# Altium project Ravage.PrjPcb (part 1 of 2)
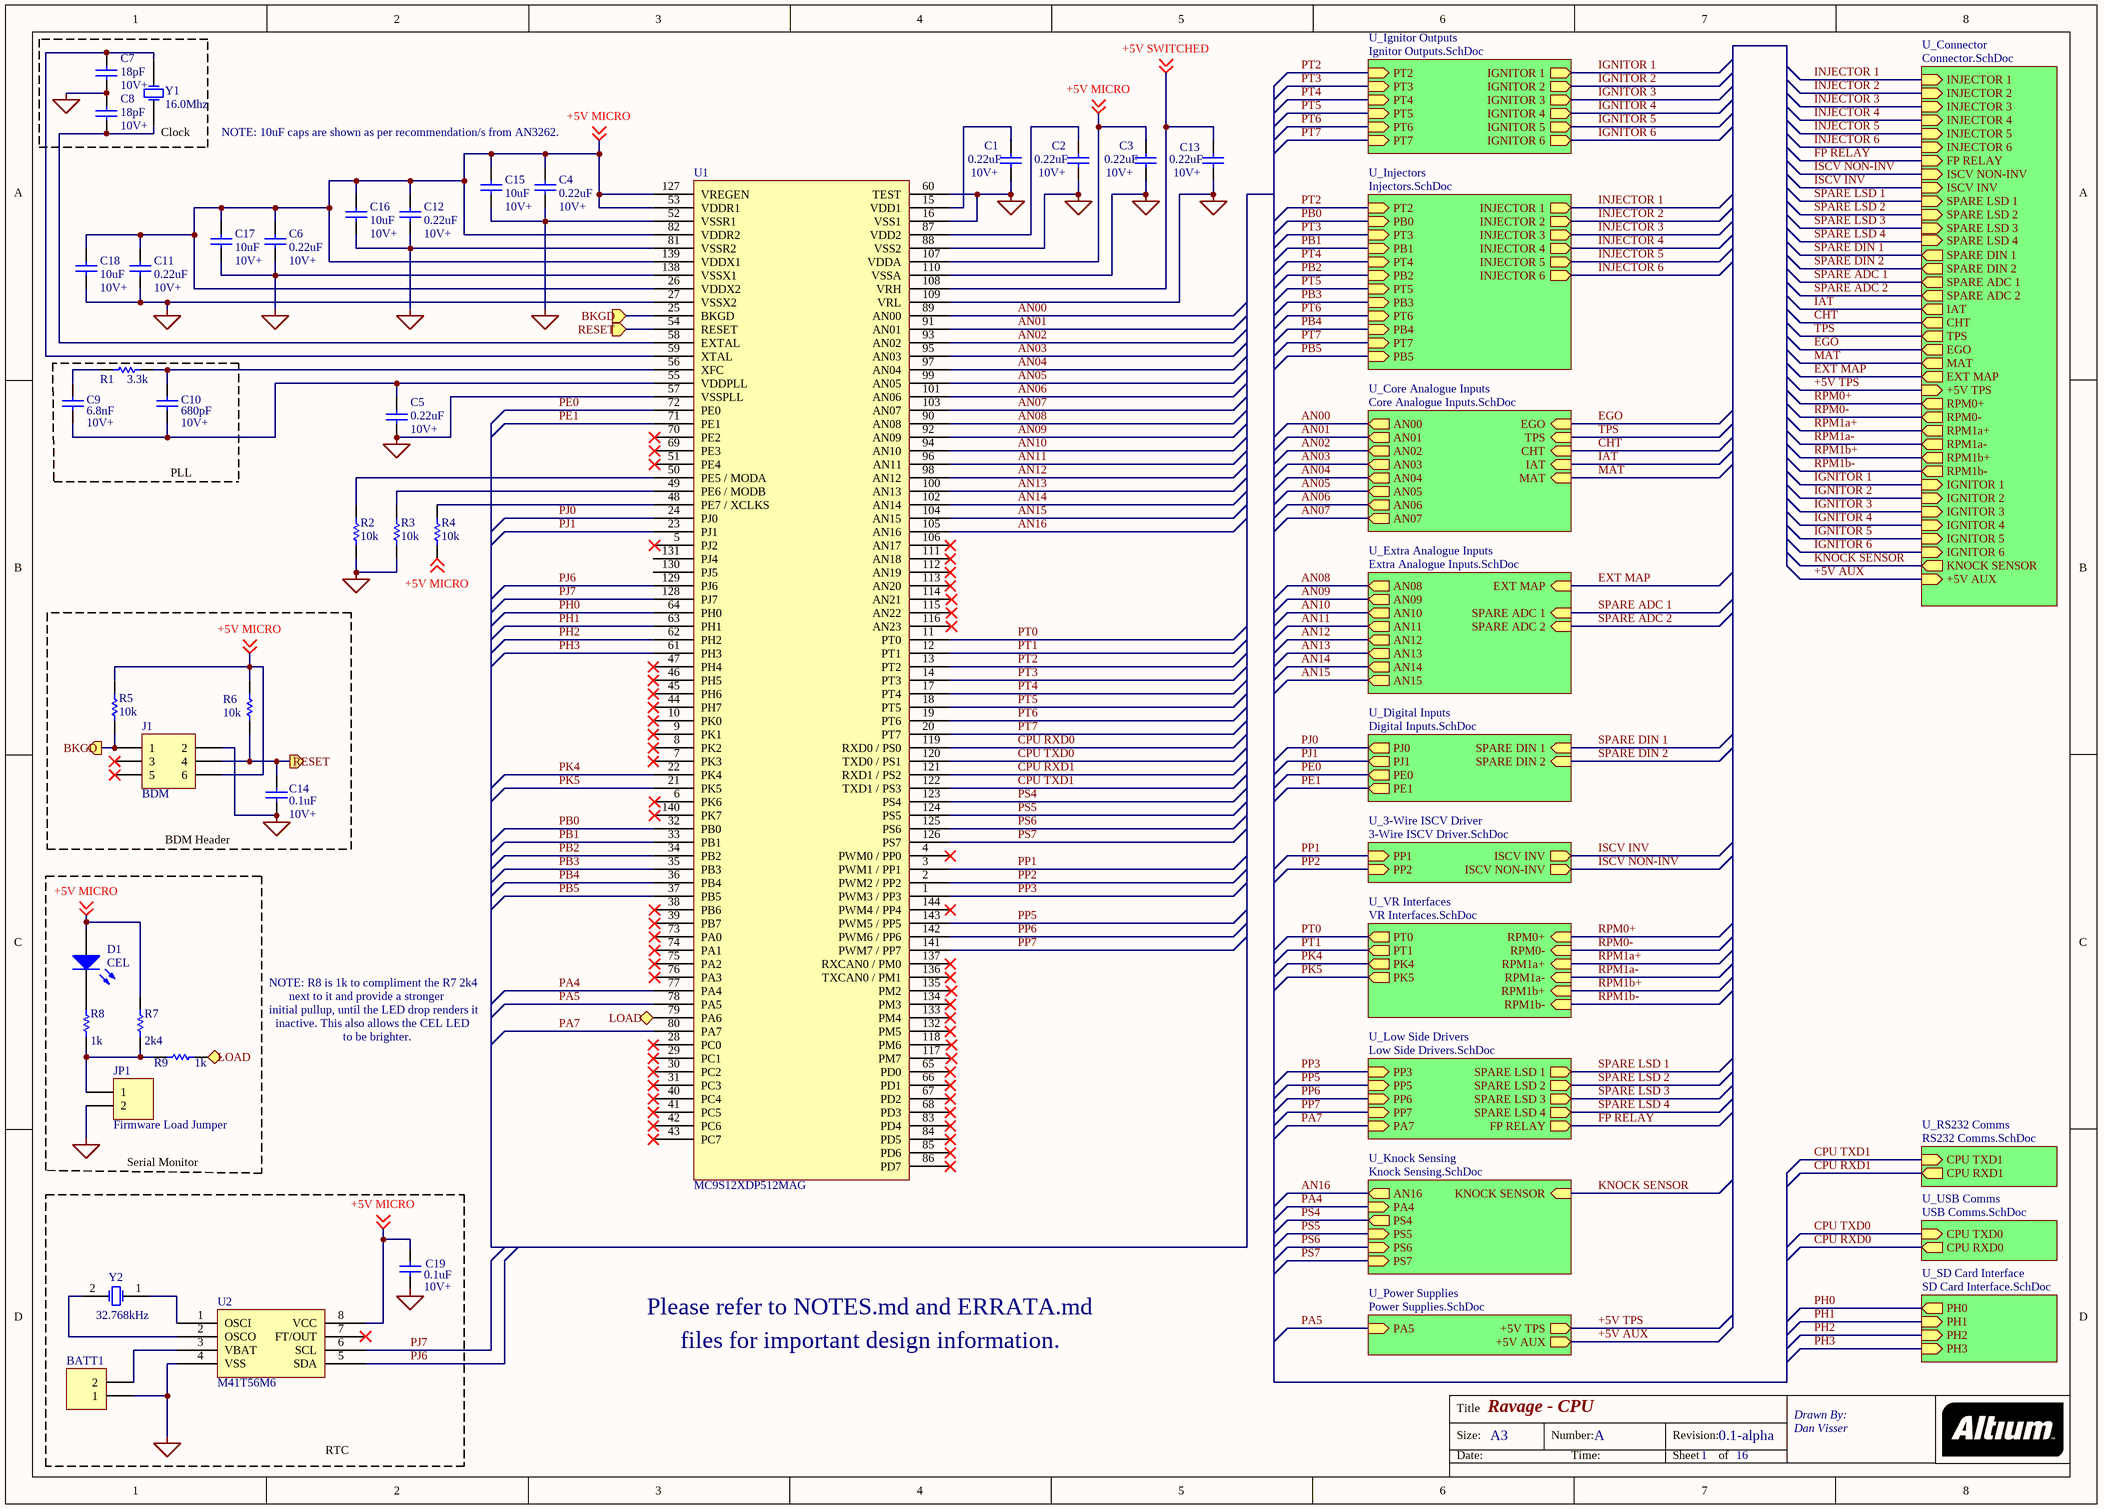
[diagram p0: CPU.SchDoc]
16 sheets, 377 parts. Net scope: hierarchical (ports join the sheet entries above them; power ports are global).
Board file: RavAGE-0.1-alpha.PcbDoc
Sheets:
  CPU.SchDoc
    U_Ignitor Outputs = Ignitor Outputs.SchDoc
    U_Injectors = Injectors.SchDoc
    U_Digital Inputs = Digital Inputs.SchDoc
    U_USB Comms = USB Comms.SchDoc
    U_3-Wire ISCV Driver = 3-Wire ISCV Driver.SchDoc
    U_Power Supplies = Power Supplies.SchDoc
    U_VR Interfaces = VR Interfaces.SchDoc
    U_Connector = Connector.SchDoc
    U_RS232 Comms = RS232 Comms.SchDoc
    U_Core Analogue Inputs = Core Analogue Inputs.SchDoc
    U_Extra Analogue Inputs = Extra Analogue Inputs.SchDoc
    U_Low Side Drivers = Low Side Drivers.SchDoc
    U_Knock Sensing = Knock Sensing.SchDoc
    U_SD Card Interface = SD Card Interface.SchDoc
  IO Expansion Header.SchDoc

## Sheet CPU.SchDoc: Ravage - CPU
size A3; Author: Dan Visser; CompanyName: DIYEFI; DrawnBy: Dan Visser; Engineer: Dan Visser; Address1: Drawn By:; Address2: Dan Visser; DocumentNumber: A; Revision: 0.1-alpha; SheetNumber: 1; SheetTotal: 16

### Parts
BATT1  (no value)  [HDR1X2]
C1  value 0.22uF  [RAD-0.3]
C2  value 0.22uF  [RAD-0.3]
C3  value 0.22uF  [RAD-0.3]
C4  value 0.22uF  [RAD-0.3]
C5  value 0.22uF  [RAD-0.3]
C6  value 0.22uF  [RAD-0.3]
C7  value 18pF  [RAD-0.3]
C8  value 18pF  [RAD-0.3]
C9  value 6.8nF  [RAD-0.3]
C10  value 680pF  [RAD-0.3]
C11  value 0.22uF  [RAD-0.3]
C12  value 0.22uF  [RAD-0.3]
C13  value 0.22uF  [RAD-0.3]
C14  value 0.1uF  [RAD-0.3]
C15  value 10uF  [RAD-0.3]
C16  value 10uF  [RAD-0.3]
C17  value 10uF  [RAD-0.3]
C18  value 10uF  [RAD-0.3]
C19  value 0.1uF  [RAD-0.3]
D1  CEL  [LED-0]
J1  BDM  [HDR2X3]
JP1  Firmware Load Jumper  [HDR1X2]
R1  value 3.3k  [AXIAL-0.3]
R2  value 10k  [AXIAL-0.3]
R3  value 10k  [AXIAL-0.3]
R4  value 10k  [AXIAL-0.3]
R5  value 10k  [AXIAL-0.3]
R6  value 10k  [AXIAL-0.3]
R7  value 2k4  [AXIAL-0.3]
R8  value 1k  [AXIAL-0.3]
R9  value 1k  [AXIAL-0.3]
U1  MC9S12XDP512MAG
U2  M41T56M6
Y1  16.0Mhz  [R38]
Y2  32.768kHz  [R38]

### Blocks framed on the sheet
Serial Monitor: D1 JP1 R7-R9

### Sub-sheets
U_3-Wire ISCV Driver = 3-Wire ISCV Driver.SchDoc: PP1 (in), ISCV INV (out), ISCV NON-INV (out), PP2 (in)
U_Connector = Connector.SchDoc: INJECTOR 1 (in), INJECTOR 2 (in), INJECTOR 3 (in), INJECTOR 4 (in), INJECTOR 5 (in), INJECTOR 6 (in), FP RELAY (in), ISCV NON-INV (in), ISCV INV (in), SPARE LSD 1 (in), SPARE LSD 2 (in), IGNITOR 1 (in), RPM0+ (out), RPM0- (out), RPM1a+ (out), RPM1a- (out), RPM1b+ (out), RPM1b- (out), IAT (out), CHT (out), TPS (out), EGO (out), MAT (out), EXT MAP (out), SPARE ADC 1 (out), SPARE ADC 2 (out), SPARE DIN 1 (out), SPARE DIN 2 (out), IGNITOR 2 (in), IGNITOR 3 (in), IGNITOR 4 (in), IGNITOR 5 (in), IGNITOR 6 (in), SPARE LSD 3 (in), +5V TPS (in), SPARE LSD 4 (in), KNOCK SENSOR (out), +5V AUX (in)
U_Core Analogue Inputs = Core Analogue Inputs.SchDoc: AN00 (out), AN01 (out), AN02 (out), AN03 (out), AN04 (out), EGO (in), TPS (in), CHT (in), IAT (in), AN05 (out), AN06 (out), AN07 (out), MAT (in)
U_Digital Inputs = Digital Inputs.SchDoc: PJ0 (out), PE0 (out), PE1 (out), SPARE DIN 1 (in), PJ1 (out), SPARE DIN 2 (in)
U_Extra Analogue Inputs = Extra Analogue Inputs.SchDoc: AN08 (out), AN09 (out), AN14 (out), AN13 (out), AN12 (out), AN11 (out), AN10 (out), SPARE ADC 1 (in), SPARE ADC 2 (in), AN15 (out), EXT MAP (in)
U_Ignitor Outputs = Ignitor Outputs.SchDoc: PT3 (in), PT2 (in), PT4 (in), PT5 (in), PT7 (in), PT6 (in), IGNITOR 1 (out), IGNITOR 2 (out), IGNITOR 3 (out), IGNITOR 4 (out), IGNITOR 5 (out), IGNITOR 6 (out)
U_Injectors = Injectors.SchDoc: PB0 (in), PB1 (in), PB2 (in), PB5 (in), PT7 (in), INJECTOR 3 (out), PB4 (in), PT6 (in), INJECTOR 5 (out), INJECTOR 2 (out), INJECTOR 1 (out), INJECTOR 4 (out), PT5 (in), PB3 (in), PT2 (in), PT3 (in), PT4 (in), INJECTOR 6 (out)
U_Knock Sensing = Knock Sensing.SchDoc: PA4 (in), PS6 (in), PS7 (in), PS5 (in), AN16 (out), PS4 (out), KNOCK SENSOR (in)
U_Low Side Drivers = Low Side Drivers.SchDoc: PP3 (in), PP5 (in), PA7 (in), PP7 (in), SPARE LSD 3 (out), FP RELAY (out), SPARE LSD 4 (out), SPARE LSD 2 (out), SPARE LSD 1 (out), PP6 (in)
U_Power Supplies = Power Supplies.SchDoc: PA5 (in), +5V TPS (out), +5V AUX (out)
U_RS232 Comms = RS232 Comms.SchDoc: CPU TXD1 (in), CPU RXD1 (out)
U_SD Card Interface = SD Card Interface.SchDoc: PH0 (out), PH1 (in), PH2 (in), PH3 (in)
U_USB Comms = USB Comms.SchDoc: CPU TXD0 (in), CPU RXD0 (out)
U_VR Interfaces = VR Interfaces.SchDoc: PT1 (out), PT0 (out), PK4 (out), RPM1b- (in), RPM1b+ (in), RPM1a+ (in), RPM1a- (in), RPM0- (in), RPM0+ (in), PK5 (out)

### Ports
BKGD (in), BKGD (out), LOAD (bidir), RESET (in), RESET (out)

### Nets
SENSOR GND: BATT1.1 C1.1 C2.1 C3.1 C4.1 C5.2 C6.1 C7.1 C8.2 C11.1 C12.1 C13.1 C14.2 C15.1 C16.1 C17.1 C18.1 C19.2 J1.2 JP1.2 R2.1 R3.1 U1.16(VSS1) U1.27(VSSX2) U1.52(VSSR1) U1.57(VSSPLL) U1.60(TEST) U1.81(VSSR2) U1.88(VSS2) U1.109(VRL) U1.110(VSSA) U1.138(VSSX1) U2.4(VSS)
+5V AUX: sheet U_Power Supplies/+5V AUX, sheet U_Connector/+5V AUX
+5V MICRO: C3.2 C4.2 C6.2 C11.2 C12.2 C15.2 C16.2 C17.2 C18.2 C19.1 D1.1(A) J1.6 R4.1 R5.2 R6.2 R7.2 U1.26(VDDX2) U1.53(VDDR1) U1.82(VDDR2) U1.107(VDDA) U1.127(VREGEN) U1.139(VDDX1) U2.8(VCC) ; off-sheet +5V MICRO
+5V SWITCHED: C13.2 U1.108(VRH) ; off-sheet +5V SWITCHED
+5V TPS: sheet U_Power Supplies/+5V TPS, sheet U_Connector/+5V TPS
AN00: U1.89(AN00) ; sheet U_Core Analogue Inputs/AN00
AN01: U1.91(AN01) ; sheet U_Core Analogue Inputs/AN01
AN02: U1.93(AN02) ; sheet U_Core Analogue Inputs/AN02
AN03: U1.95(AN03) ; sheet U_Core Analogue Inputs/AN03
AN04: U1.97(AN04) ; sheet U_Core Analogue Inputs/AN04
AN05: U1.99(AN05) ; sheet U_Core Analogue Inputs/AN05
AN06: U1.101(AN06) ; sheet U_Core Analogue Inputs/AN06
AN07: U1.103(AN07) ; sheet U_Core Analogue Inputs/AN07
AN08: U1.90(AN08) ; sheet U_Extra Analogue Inputs/AN08
AN09: U1.92(AN09) ; sheet U_Extra Analogue Inputs/AN09
AN10: U1.94(AN10) ; sheet U_Extra Analogue Inputs/AN10
AN11: U1.96(AN11) ; sheet U_Extra Analogue Inputs/AN11
AN12: U1.98(AN12) ; sheet U_Extra Analogue Inputs/AN12
AN13: U1.100(AN13) ; sheet U_Extra Analogue Inputs/AN13
AN14: U1.102(AN14) ; sheet U_Extra Analogue Inputs/AN14
AN15: U1.104(AN15) ; sheet U_Extra Analogue Inputs/AN15
AN16: U1.105(AN16) ; sheet U_Knock Sensing/AN16
CHT: sheet U_Connector/CHT, sheet U_Core Analogue Inputs/CHT
CPU RXD0: U1.119(RXD0_/_PS0) ; sheet U_USB Comms/CPU RXD0
CPU RXD1: U1.121(RXD1_/_PS2) ; sheet U_RS232 Comms/CPU RXD1
CPU TXD0: U1.120(TXD0_/_PS1) ; sheet U_USB Comms/CPU TXD0
CPU TXD1: U1.122(TXD1_/_PS3) ; sheet U_RS232 Comms/CPU TXD1
EGO: sheet U_Connector/EGO, sheet U_Core Analogue Inputs/EGO
EXT MAP: sheet U_Connector/EXT MAP, sheet U_Extra Analogue Inputs/EXT MAP
FP RELAY: sheet U_Connector/FP RELAY, sheet U_Low Side Drivers/FP RELAY
IAT: sheet U_Connector/IAT, sheet U_Core Analogue Inputs/IAT
IGNITOR 1: sheet U_Ignitor Outputs/IGNITOR 1, sheet U_Connector/IGNITOR 1
IGNITOR 2: sheet U_Ignitor Outputs/IGNITOR 2, sheet U_Connector/IGNITOR 2
IGNITOR 3: sheet U_Ignitor Outputs/IGNITOR 3, sheet U_Connector/IGNITOR 3
IGNITOR 4: sheet U_Ignitor Outputs/IGNITOR 4, sheet U_Connector/IGNITOR 4
IGNITOR 5: sheet U_Ignitor Outputs/IGNITOR 5, sheet U_Connector/IGNITOR 5
IGNITOR 6: sheet U_Ignitor Outputs/IGNITOR 6, sheet U_Connector/IGNITOR 6
INJECTOR 1: sheet U_Injectors/INJECTOR 1, sheet U_Connector/INJECTOR 1
INJECTOR 2: sheet U_Injectors/INJECTOR 2, sheet U_Connector/INJECTOR 2
INJECTOR 3: sheet U_Injectors/INJECTOR 3, sheet U_Connector/INJECTOR 3
INJECTOR 4: sheet U_Injectors/INJECTOR 4, sheet U_Connector/INJECTOR 4
INJECTOR 5: sheet U_Injectors/INJECTOR 5, sheet U_Connector/INJECTOR 5
INJECTOR 6: sheet U_Injectors/INJECTOR 6, sheet U_Connector/INJECTOR 6
ISCV INV: sheet U_3-Wire ISCV Driver/ISCV INV, sheet U_Connector/ISCV INV
ISCV NON-INV: sheet U_3-Wire ISCV Driver/ISCV NON-INV, sheet U_Connector/ISCV NON-INV
KNOCK SENSOR: sheet U_Connector/KNOCK SENSOR, sheet U_Knock Sensing/KNOCK SENSOR
MAT: sheet U_Connector/MAT, sheet U_Core Analogue Inputs/MAT
PA4: U1.77(PA4) ; sheet U_Knock Sensing/PA4
PA5: U1.78(PA5) ; sheet U_Power Supplies/PA5
PA7: U1.80(PA7) ; sheet U_Low Side Drivers/PA7
PB0: U1.32(PB0) ; sheet U_Injectors/PB0
PB1: U1.33(PB1) ; sheet U_Injectors/PB1
PB2: U1.34(PB2) ; sheet U_Injectors/PB2
PB3: U1.35(PB3) ; sheet U_Injectors/PB3
PB4: U1.36(PB4) ; sheet U_Injectors/PB4
PB5: U1.37(PB5) ; sheet U_Injectors/PB5
PE0: U1.72(PE0) ; sheet U_Digital Inputs/PE0
PE1: U1.71(PE1) ; sheet U_Digital Inputs/PE1
PH0: U1.64(PH0) ; sheet U_SD Card Interface/PH0
PH1: U1.63(PH1) ; sheet U_SD Card Interface/PH1
PH2: U1.62(PH2) ; sheet U_SD Card Interface/PH2
PH3: U1.61(PH3) ; sheet U_SD Card Interface/PH3
PJ0: U1.24(PJ0) ; sheet U_Digital Inputs/PJ0
PJ1: U1.23(PJ1) ; sheet U_Digital Inputs/PJ1
PJ6: U1.129(PJ6) U2.5(SDA)
PJ7: U1.128(PJ7) U2.6(SCL)
PK4: U1.22(PK4) ; sheet U_VR Interfaces/PK4
PK5: U1.21(PK5) ; sheet U_VR Interfaces/PK5
PP1: U1.3(PWM1_/_PP1) ; sheet U_3-Wire ISCV Driver/PP1
PP2: U1.2(PWM2_/_PP2) ; sheet U_3-Wire ISCV Driver/PP2
PP3: U1.1(PWM3_/_PP3) ; sheet U_Low Side Drivers/PP3
PP5: U1.143(PWM5_/_PP5) ; sheet U_Low Side Drivers/PP5
PP6: U1.142(PWM6_/_PP6) ; sheet U_Low Side Drivers/PP6
PP7: U1.141(PWM7_/_PP7) ; sheet U_Low Side Drivers/PP7
PS4: U1.123(PS4) ; sheet U_Knock Sensing/PS4
PS5: U1.124(PS5) ; sheet U_Knock Sensing/PS5
PS6: U1.125(PS6) ; sheet U_Knock Sensing/PS6
PS7: U1.126(PS7) ; sheet U_Knock Sensing/PS7
PT0: U1.11(PT0) ; sheet U_VR Interfaces/PT0
PT1: U1.12(PT1) ; sheet U_VR Interfaces/PT1
PT2: U1.13(PT2) ; sheet U_Ignitor Outputs/PT2, sheet U_Injectors/PT2
PT3: U1.14(PT3) ; sheet U_Ignitor Outputs/PT3, sheet U_Injectors/PT3
PT4: U1.17(PT4) ; sheet U_Ignitor Outputs/PT4, sheet U_Injectors/PT4
PT5: U1.18(PT5) ; sheet U_Ignitor Outputs/PT5, sheet U_Injectors/PT5
PT6: U1.19(PT6) ; sheet U_Ignitor Outputs/PT6, sheet U_Injectors/PT6
PT7: U1.20(PT7) ; sheet U_Ignitor Outputs/PT7, sheet U_Injectors/PT7
RPM0+: sheet U_VR Interfaces/RPM0+, sheet U_Connector/RPM0+
RPM0-: sheet U_VR Interfaces/RPM0-, sheet U_Connector/RPM0-
RPM1a+: sheet U_VR Interfaces/RPM1a+, sheet U_Connector/RPM1a+
RPM1a-: sheet U_VR Interfaces/RPM1a-, sheet U_Connector/RPM1a-
RPM1b+: sheet U_VR Interfaces/RPM1b+, sheet U_Connector/RPM1b+
RPM1b-: sheet U_VR Interfaces/RPM1b-, sheet U_Connector/RPM1b-
SPARE ADC 1: sheet U_Connector/SPARE ADC 1, sheet U_Extra Analogue Inputs/SPARE ADC 1
SPARE ADC 2: sheet U_Connector/SPARE ADC 2, sheet U_Extra Analogue Inputs/SPARE ADC 2
SPARE DIN 1: sheet U_Digital Inputs/SPARE DIN 1, sheet U_Connector/SPARE DIN 1
SPARE DIN 2: sheet U_Digital Inputs/SPARE DIN 2, sheet U_Connector/SPARE DIN 2
SPARE LSD 1: sheet U_Connector/SPARE LSD 1, sheet U_Low Side Drivers/SPARE LSD 1
SPARE LSD 2: sheet U_Connector/SPARE LSD 2, sheet U_Low Side Drivers/SPARE LSD 2
SPARE LSD 3: sheet U_Connector/SPARE LSD 3, sheet U_Low Side Drivers/SPARE LSD 3
TPS: sheet U_Connector/TPS, sheet U_Core Analogue Inputs/TPS
NetBATT1_2: BATT1.2 U2.3(VBAT)
NetC1_2: C1.2 U1.15(VDD1)
NetC2_2: C2.2 U1.87(VDD2)
NetC5_1: C5.1 C9.1 C10.1 U1.55(VDDPLL)
NetC7_2: C7.2 U1.59(XTAL) Y1.2(OSC2)
NetC8_1: C8.1 U1.58(EXTAL) Y1.1(OSC1)
NetC9_2: C9.2 R1.1
NetC10_2: C10.2 R1.2 U1.56(XFC)
NetC14_1: C14.1 J1.4 R6.1 U1.54(RESET) ; port RESET
NetD1_2: D1.2(K) R8.2
NetJ1_1: J1.1 R5.1 U1.25(BKGD) ; port BKGD
NetJP1_1: JP1.1 R7.1 R8.1 R9.1
NetR2_2: R2.2 U1.50(PE5_/_MODA)
NetR3_2: R3.2 U1.49(PE6_/_MODB)
NetR4_2: R4.2 U1.48(PE7_/_XCLKS)
NetR9_2: R9.2 U1.79(PA6) ; port LOAD
NetU2_1: U2.1(OSCI) Y2.1(OSC1)
NetU2_2: U2.2(OSCO) Y2.2(OSC2)

Not connected (* = marked no-connect by the designer): J1 3* 5*; U1 4(PWM0_/_PP0)* 5(PJ2) 6(PK6) 7(PK3)* 8(PK2)* 9(PK1)* 10(PK0)* 28(PC0)* 29(PC1)* 30(PC2)* 31(PC3)* 38(PB6) 39(PB7) 40(PC4)* 41(PC5)* 42(PC6)* 43(PC7)* 44(PH7)* 45(PH6)* 46(PH5)* 47(PH4)* 51(PE4) 65(PD0)* 66(PD1)* 67(PD2)* 68(PD3)* 69(PE3) 70(PE2) 73(PA0) 74(PA1) 75(PA2) 76(PA3) 83(PD4)* 84(PD5)* 85(PD6)* 86(PD7)* 106(AN17)* 111(AN18)* 112(AN19)* 113(AN20)* 114(AN21) 115(AN22) 116(AN23) 117(PM7) 118(PM6) 130(PJ5) 131(PJ4) 132(PM5)* 133(PM4)* 134(PM3)* 135(PM2) 136(TXCAN0_/_PM1)* 137(RXCAN0_/_PM0)* 140(PK7) 144(PWM4_/_PP4)*; U2 7(FT/OUT)*

### Notes on the sheet
- 10V+
- (near Y1) Clock
- NOTE: 10uF caps are shown as per recommendation/s from AN3262.
- (near C1) 10V+
- (near C12) 10V+
- (near C4) 10V+
- (near C11) 10V+
- (near C6) 10V+
- (near C9) 10V+
- (near C10) 10V+
- (near C5) 10V+
- PLL
- BDM Header
- (near C14) 10V+
- NOTE: R8 is 1k to compliment the R7 2k4
- initial pullup, until the LED drop renders it
- inactive. This also allows the CEL LED
- next to it and provide a stronger
- to be brighter.
- (near C19) 10V+
- Please refer to NOTES.md and ERRATA.md
- files for important design information.
- RTC
- Title
- Size:
- Date:
- A3
- Number:
- Time:
- Revision:
- Sheet
- of

### Library data of the parts
BATT1 JP1 = Header 2: Header, 2-Pin; LatestRevisionDate: 17-Jul-2002; LatestRevisionNote: Re-released for DXP Platform.; Publisher: Altium Limited
C1-C19 = Cap: Capacitor; Published: 8-Jun-2000; LatestRevisionDate: 17-Jul-2002; LatestRevisionNote: Re-released for DXP Platform.; PackageReference: RAD-0.3; Publisher: Altium Limited; PackageDescription: Radial Cap, Thru-Hole; 2 Leads; 0.3 in Pin Spacing
D1 = LED0: 0805 Package; Published: 8-Jun-2000; LatestRevisionDate: 08-Jul-2005; LatestRevisionNote: Mech Layer 1 removed.; PackageReference: LED-0; Publisher: Altium Limited; PackageDescription: LED; 2 Leads
J1 = Header 3X2: Header, 3-Pin, Dual row; LatestRevisionDate: 17-Jul-2002; LatestRevisionNote: Re-released for DXP Platform.; Publisher: Altium Limited
R1-R9 = Res1: Resistor; Published: 8-Jun-2000; LatestRevisionDate: 17-Jul-2002; LatestRevisionNote: Re-released for DXP Platform.; PackageReference: AXIAL-0.3; Publisher: Altium Limited; PackageDescription: Axial Device, Thru-Hole; 2 Leads; 0.3 in Pin Spacing
U1 = MC9S12XDP512VAG
U2 = M41T56M6E
Y1 Y2 = XTAL: Crystal Oscillator; Published: 8-Jun-2000; LatestRevisionDate: 17-Jul-2002; LatestRevisionNote: Re-released for DXP Platform.; PackageReference: R38; Publisher: Altium Limited; PackageDescription: Crystal, Thru-Hole; 2 Leads; Body 3.1 x 8.2 mm (Dia.xH)

## Sheet Ignitor Outputs.SchDoc: Ravage - Ignitor Outputs
size A4; Address1: Drawn By:; Address2: Dan Visser; DocumentNumber: A; Revision: 0.1-alpha; SheetNumber: 10; SheetTotal: 16
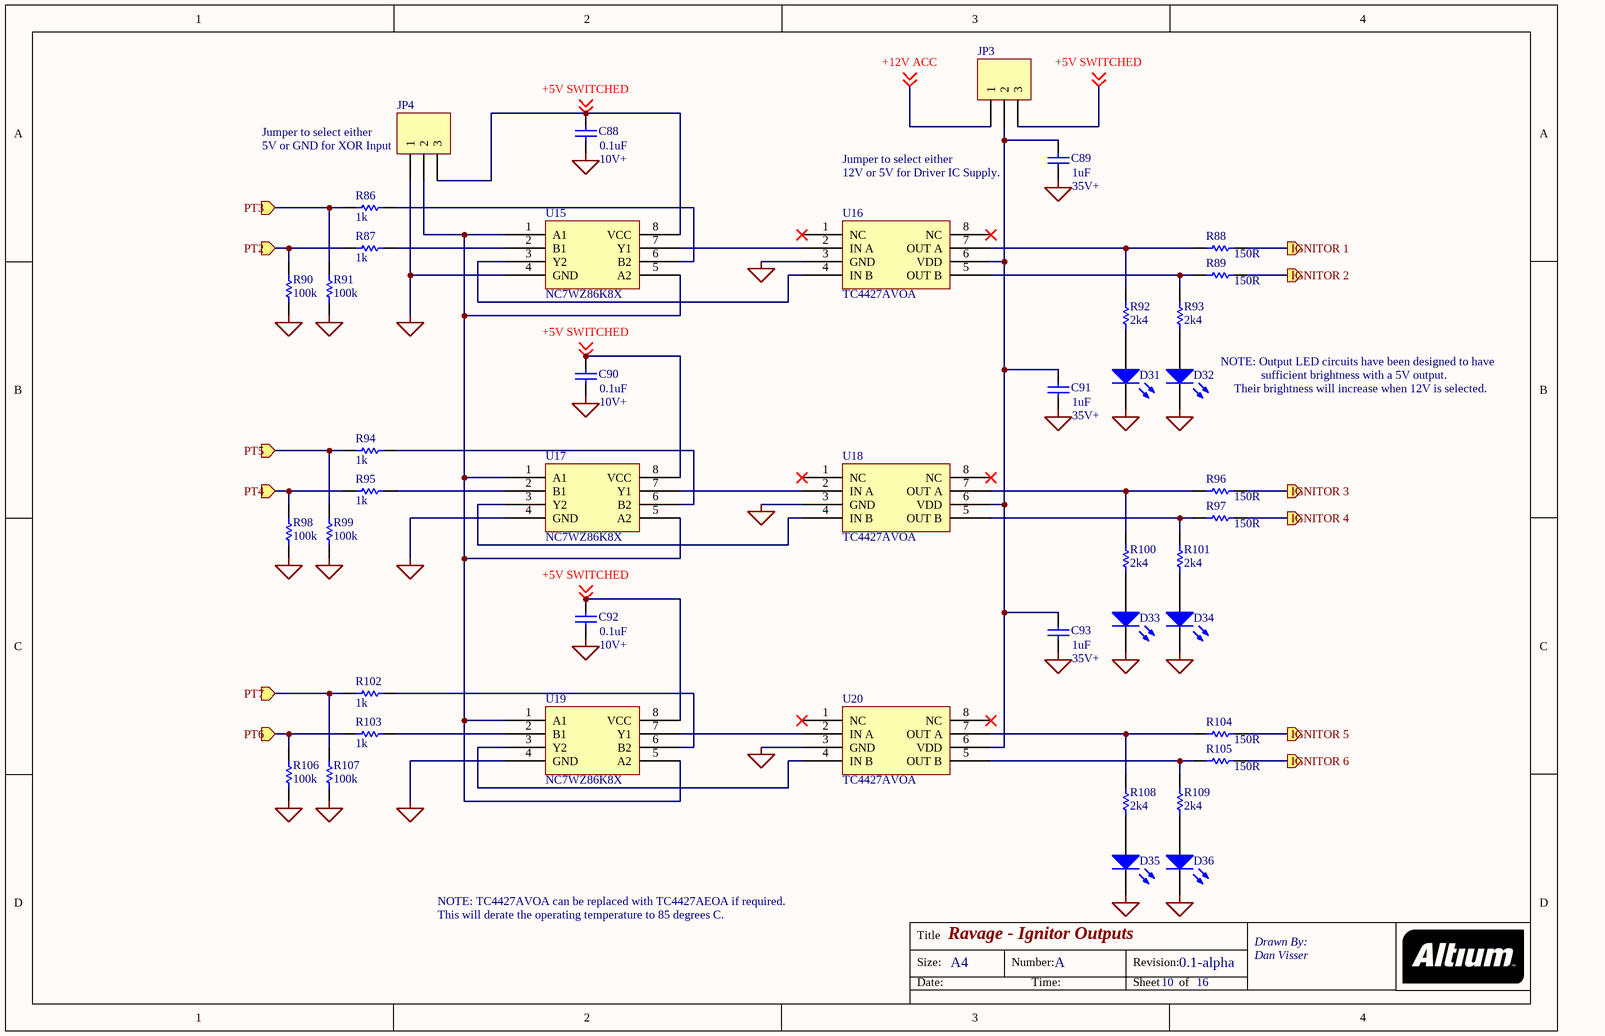
[diagram p1: Ignitor Outputs.SchDoc]

### Parts
C88  value 0.1uF  [RAD-0.3]
C89  value 1uF  [RAD-0.3]
C90  value 0.1uF  [RAD-0.3]
C91  value 1uF  [RAD-0.3]
C92  value 0.1uF  [RAD-0.3]
C93  value 1uF  [RAD-0.3]
D31  (no value)  [LED-0]
D32  (no value)  [LED-0]
D33  (no value)  [LED-0]
D34  (no value)  [LED-0]
D35  (no value)  [LED-0]
D36  (no value)  [LED-0]
JP3  (no value)  [HDR1X3]
JP4  (no value)  [HDR1X3]
R86  value 1k  [AXIAL-0.3]
R87  value 1k  [AXIAL-0.3]
R88  value 150R  [AXIAL-0.3]
R89  value 150R  [AXIAL-0.3]
R90  value 100k  [AXIAL-0.3]
R91  value 100k  [AXIAL-0.3]
R92  value 2k4  [AXIAL-0.3]
R93  value 2k4  [AXIAL-0.3]
R94  value 1k  [AXIAL-0.3]
R95  value 1k  [AXIAL-0.3]
R96  value 150R  [AXIAL-0.3]
R97  value 150R  [AXIAL-0.3]
R98  value 100k  [AXIAL-0.3]
R99  value 100k  [AXIAL-0.3]
R100  value 2k4  [AXIAL-0.3]
R101  value 2k4  [AXIAL-0.3]
R102  value 1k  [AXIAL-0.3]
R103  value 1k  [AXIAL-0.3]
R104  value 150R  [AXIAL-0.3]
R105  value 150R  [AXIAL-0.3]
R106  value 100k  [AXIAL-0.3]
R107  value 100k  [AXIAL-0.3]
R108  value 2k4  [AXIAL-0.3]
R109  value 2k4  [AXIAL-0.3]
U15  NC7WZ86K8X
U16  TC4427AVOA
U17  NC7WZ86K8X
U18  TC4427AVOA
U19  NC7WZ86K8X
U20  TC4427AVOA

### Ports
IGNITOR 1 (out), IGNITOR 2 (out), IGNITOR 3 (out), IGNITOR 4 (out), IGNITOR 5 (out), IGNITOR 6 (out), PT2 (in), PT3 (in), PT4 (in), PT5 (in), PT6 (in), PT7 (in)

### Nets
SENSOR GND: C88.1 C89.1 C90.1 C91.1 C92.1 C93.1 D31.2(K) D32.2(K) D33.2(K) D34.2(K) D35.2(K) D36.2(K) JP4.1 R90.1 R91.1 R98.1 R99.1 R106.1 R107.1 U15.4(GND) U16.3(GND) U17.4(GND) U18.3(GND) U19.4(GND) U20.3(GND)
+5V SWITCHED: C88.2 C90.2 C92.2 JP3.3 JP4.3 U15.8(VCC) U17.8(VCC) U19.8(VCC) ; off-sheet +5V SWITCHED
+12V ACC: JP3.1 ; off-sheet +12V ACC
IGNITOR 1: R88.2 ; port IGNITOR 1
IGNITOR 2: R89.2 ; port IGNITOR 2
IGNITOR 3: R96.2 ; port IGNITOR 3
IGNITOR 4: R97.2 ; port IGNITOR 4
IGNITOR 5: R104.2 ; port IGNITOR 5
IGNITOR 6: R105.2 ; port IGNITOR 6
PT2: R87.2 R90.2 ; port PT2
PT3: R86.2 R91.2 ; port PT3
PT4: R95.2 R98.2 ; port PT4
PT5: R94.2 R99.2 ; port PT5
PT6: R103.2 R106.2 ; port PT6
PT7: R102.2 R107.2 ; port PT7
NetC89_2: C89.2 C91.2 C93.2 JP3.2 U16.6(VDD) U18.6(VDD) U20.6(VDD)
NetD31_1: D31.1(A) R92.1
NetD32_1: D32.1(A) R93.1
NetD33_1: D33.1(A) R100.1
NetD34_1: D34.1(A) R101.1
NetD35_1: D35.1(A) R108.1
NetD36_1: D36.1(A) R109.1
NetJP4_2: JP4.2 U15.1(A1) U15.5(A2) U17.1(A1) U17.5(A2) U19.1(A1) U19.5(A2)
NetR86_1: R86.1 U15.6(B2)
NetR87_1: R87.1 U15.2(B1)
NetR88_1: R88.1 R92.2 U16.7(OUT_A)
NetR89_1: R89.1 R93.2 U16.5(OUT_B)
NetR94_1: R94.1 U17.6(B2)
NetR95_1: R95.1 U17.2(B1)
NetR96_1: R96.1 R100.2 U18.7(OUT_A)
NetR97_1: R97.1 R101.2 U18.5(OUT_B)
NetR102_1: R102.1 U19.6(B2)
NetR103_1: R103.1 U19.2(B1)
NetR104_1: R104.1 R108.2 U20.7(OUT_A)
NetR105_1: R105.1 R109.2 U20.5(OUT_B)
NetU15_3: U15.3(Y2) U16.4(IN_B)
NetU15_7: U15.7(Y1) U16.2(IN_A)
NetU17_3: U17.3(Y2) U18.4(IN_B)
NetU17_7: U17.7(Y1) U18.2(IN_A)
NetU19_3: U19.3(Y2) U20.4(IN_B)
NetU19_7: U19.7(Y1) U20.2(IN_A)

Not connected (* = marked no-connect by the designer): U16 1(NC)* 8(NC)*; U18 1(NC)* 8(NC)*; U20 1(NC)* 8(NC)*

### Notes on the sheet
- (near JP4) Jumper to select either
- (near JP4) 5V or GND for XOR Input
- (near C88) 10V+
- Jumper to select either
- (near C89) 12V or 5V for Driver IC Supply.
- (near C89) 35V+
- NOTE: Output LED circuits have been designed to have
- sufficient brightness with a 5V output.
- (near C90) 10V+
- (near C91) 35V+
- Their brightness will increase when 12V is selected.
- (near C92) 10V+
- (near C93) 35V+
- NOTE: TC4427AVOA can be replaced with TC4427AEOA if required.
- This will derate the operating temperature to 85 degrees C.
- Title
- Size:
- Date:
- A4
- Number:
- Time:
- Revision:
- Sheet
- of

### Library data of the parts
C88-C93 = Cap: Capacitor; Published: 8-Jun-2000; LatestRevisionDate: 17-Jul-2002; LatestRevisionNote: Re-released for DXP Platform.; PackageReference: RAD-0.3; Publisher: Altium Limited; PackageDescription: Radial Cap, Thru-Hole; 2 Leads; 0.3 in Pin Spacing
D31-D36 = LED0: Typical INFRARED GaAs LED; Published: 8-Jun-2000; LatestRevisionDate: 08-Jul-2005; LatestRevisionNote: Mech Layer 1 removed.; PackageReference: LED-0; Publisher: Altium Limited; PackageDescription: LED; 2 Leads
JP3 JP4 = Header 3: Header, 3-Pin; LatestRevisionDate: 17-Jul-2002; LatestRevisionNote: Re-released for DXP Platform.; Publisher: Altium Limited
R86-R109 = Res1: Resistor; Published: 8-Jun-2000; LatestRevisionDate: 17-Jul-2002; LatestRevisionNote: Re-released for DXP Platform.; PackageReference: AXIAL-0.3; Publisher: Altium Limited; PackageDescription: Axial Device, Thru-Hole; 2 Leads; 0.3 in Pin Spacing
U16 U18 U20 = TC427COA

## Sheet Injectors.SchDoc: Ravage - Injectors
size A4; Address1: Drawn By:; Address2: Dan Visser; DocumentNumber: A; Revision: 0.1-alpha; SheetNumber: 11; SheetTotal: 16
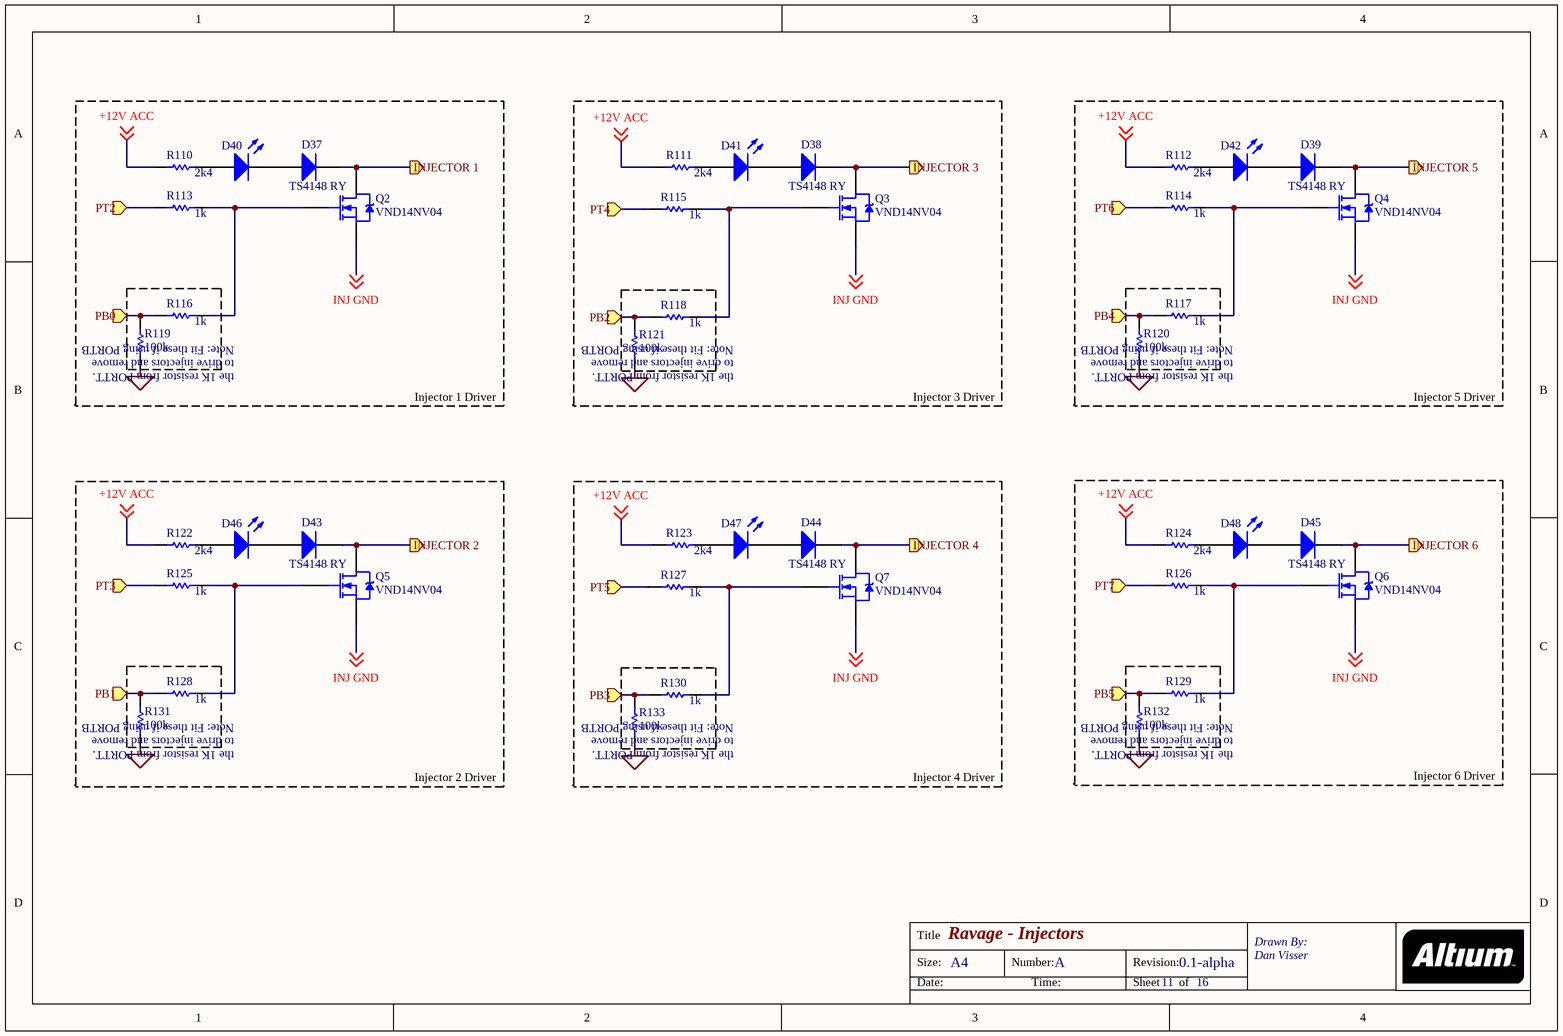
[diagram p2: Injectors.SchDoc]

### Parts
D37  TS4148 RY  [SMC]
D38  TS4148 RY  [SMC]
D39  TS4148 RY  [SMC]
D40  (no value)  [LED-0]
D41  (no value)  [LED-0]
D42  (no value)  [LED-0]
D43  TS4148 RY  [SMC]
D44  TS4148 RY  [SMC]
D45  TS4148 RY  [SMC]
D46  (no value)  [LED-0]
D47  (no value)  [LED-0]
D48  (no value)  [LED-0]
Q2  VND14NV04  [TO-220AB]
Q3  VND14NV04  [TO-220AB]
Q4  VND14NV04  [TO-220AB]
Q5  VND14NV04  [TO-220AB]
Q6  VND14NV04  [TO-220AB]
Q7  VND14NV04  [TO-220AB]
R110  value 2k4  [AXIAL-0.3]
R111  value 2k4  [AXIAL-0.3]
R112  value 2k4  [AXIAL-0.3]
R113  value 1k  [AXIAL-0.3]
R114  value 1k  [AXIAL-0.3]
R115  value 1k  [AXIAL-0.3]
R116  value 1k  [AXIAL-0.3]
R117  value 1k  [AXIAL-0.3]
R118  value 1k  [AXIAL-0.3]
R119  value 100k  [AXIAL-0.3]
R120  value 100k  [AXIAL-0.3]
R121  value 100k  [AXIAL-0.3]
R122  value 2k4  [AXIAL-0.3]
R123  value 2k4  [AXIAL-0.3]
R124  value 2k4  [AXIAL-0.3]
R125  value 1k  [AXIAL-0.3]
R126  value 1k  [AXIAL-0.3]
R127  value 1k  [AXIAL-0.3]
R128  value 1k  [AXIAL-0.3]
R129  value 1k  [AXIAL-0.3]
R130  value 1k  [AXIAL-0.3]
R131  value 100k  [AXIAL-0.3]
R132  value 100k  [AXIAL-0.3]
R133  value 100k  [AXIAL-0.3]

### Ports
INJECTOR 1 (out), INJECTOR 2 (out), INJECTOR 3 (out), INJECTOR 4 (out), INJECTOR 5 (out), INJECTOR 6 (out), PB0 (in), PB1 (in), PB2 (in), PB3 (in), PB4 (in), PB5 (in), PT2 (in), PT3 (in), PT4 (in), PT5 (in), PT6 (in), PT7 (in)

### Nets
SENSOR GND: R119.1 R120.1 R121.1 R131.1 R132.1 R133.1
+12V ACC: R110.1 R111.1 R112.1 R122.1 R123.1 R124.1 ; off-sheet +12V ACC
INJ GND: Q2.3(S) Q3.3(S) Q4.3(S) Q5.3(S) Q6.3(S) Q7.3(S) ; off-sheet INJ GND
INJECTOR 1: D37.2(K) Q2.2(D) ; port INJECTOR 1
INJECTOR 2: D43.2(K) Q5.2(D) ; port INJECTOR 2
INJECTOR 3: D38.2(K) Q3.2(D) ; port INJECTOR 3
INJECTOR 4: D44.2(K) Q7.2(D) ; port INJECTOR 4
INJECTOR 5: D39.2(K) Q4.2(D) ; port INJECTOR 5
INJECTOR 6: D45.2(K) Q6.2(D) ; port INJECTOR 6
PB0: R116.1 R119.2 ; port PB0
PB1: R128.1 R131.2 ; port PB1
PB2: R118.1 R121.2 ; port PB2
PB3: R130.1 R133.2 ; port PB3
PB4: R117.1 R120.2 ; port PB4
PB5: R129.1 R132.2 ; port PB5
PT2: R113.1 ; port PT2
PT3: R125.1 ; port PT3
PT4: R115.1 ; port PT4
PT5: R127.1 ; port PT5
PT6: R114.1 ; port PT6
PT7: R126.1 ; port PT7
NetD37_1: D37.1(A) D40.2(K)
NetD38_1: D38.1(A) D41.2(K)
NetD39_1: D39.1(A) D42.2(K)
NetD40_1: D40.1(A) R110.2
NetD41_1: D41.1(A) R111.2
NetD42_1: D42.1(A) R112.2
NetD43_1: D43.1(A) D46.2(K)
NetD44_1: D44.1(A) D47.2(K)
NetD45_1: D45.1(A) D48.2(K)
NetD46_1: D46.1(A) R122.2
NetD47_1: D47.1(A) R123.2
NetD48_1: D48.1(A) R124.2
NetQ2_1: Q2.1(G) R113.2 R116.2
NetQ3_1: Q3.1(G) R115.2 R118.2
NetQ4_1: Q4.1(G) R114.2 R117.2
NetQ5_1: Q5.1(G) R125.2 R128.2
NetQ6_1: Q6.1(G) R126.2 R129.2
NetQ7_1: Q7.1(G) R127.2 R130.2

### Notes on the sheet
- (near R116) Note: Fit these if using PORTB
- to drive injectors and remove
- the 1K resistor from PORTT.
- (near R118) Note: Fit these if using PORTB
- (near R117) Note: Fit these if using PORTB
- Injector 1 Driver
- Injector 3 Driver
- Injector 5 Driver
- (near R128) Note: Fit these if using PORTB
- (near R130) Note: Fit these if using PORTB
- (near R129) Note: Fit these if using PORTB
- Injector 2 Driver
- Injector 4 Driver
- Injector 6 Driver
- Title
- Size:
- Date:
- A4
- Number:
- Time:
- Revision:
- Sheet
- of

### Library data of the parts
D37-D39 D43-D45 = Diode: Default Diode; Published: 8-Jun-2000; LatestRevisionDate: 17-Jul-2002; LatestRevisionNote: Re-released for DXP Platform.; PackageVersion: Sep-1996; PackageReference: SMC; Publisher: Altium Limited; PackageDescription: DO-214-AB/SMC; 2 C-Bend Leads; Body 7.9 x 5.9 mm, inc. leads (LxW); Code_JEDEC: DO-214-AB
D40-D42 D46-D48 = LED0: Typical INFRARED GaAs LED; Published: 8-Jun-2000; LatestRevisionDate: 08-Jul-2005; LatestRevisionNote: Mech Layer 1 removed.; PackageReference: LED-0; Publisher: Altium Limited; PackageDescription: LED; 2 Leads
Q2-Q7 = IRL520N: HEXFET Power MOSFET; Note: Pin 2 is electrically connected to pin 4 (Drain).; Published: 8-Jun-2000; LatestRevisionDate: 17-Jul-2002; LatestRevisionNote: Re-released for DXP Platform.; DatasheetVersion: May-1998; PackageVersion: Feb-1997; PackageReference: TO-220AB; Publisher: Altium Limited; PackageDescription: TO, Thru-Hole, Vertical, Heatsink Mounted; 3 In-Line Leads; Pitch 2.54 mm; ComponentLink1Description: Manufacturer Link; ComponentLink1URL: http://www.irf.com/; ComponentLink2Description: Datasheet; ComponentLink2URL: http://www.irf.com/product-info/datasheets/data/irl520n.pdf
R110-R133 = Res1: Resistor; Published: 8-Jun-2000; LatestRevisionDate: 17-Jul-2002; LatestRevisionNote: Re-released for DXP Platform.; PackageReference: AXIAL-0.3; Publisher: Altium Limited; PackageDescription: Axial Device, Thru-Hole; 2 Leads; 0.3 in Pin Spacing

## Sheet Digital Inputs.SchDoc: Ravage - Digital Inputs
size A4; Address1: Drawn By:; Address2: Dan Visser; DocumentNumber: A; Revision: 0.1-alpha; SheetNumber: 8; SheetTotal: 16
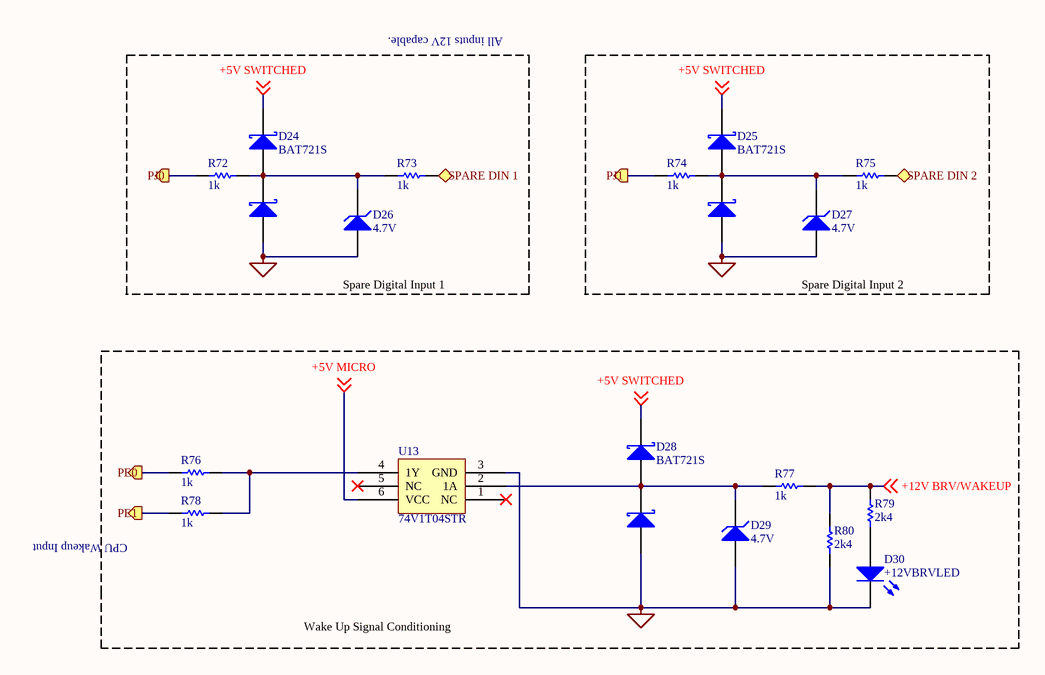
[diagram p3: Digital Inputs.SchDoc]

### Parts
D24  BAT721S
D25  BAT721S
D26  4.7V  [DIODE-0.7]
D27  4.7V  [DIODE-0.7]
D28  BAT721S
D29  4.7V  [DIODE-0.7]
D30  +12VBRVLED  [LED-0]
R72  value 1k  [AXIAL-0.3]
R73  value 1k  [AXIAL-0.3]
R74  value 1k  [AXIAL-0.3]
R75  value 1k  [AXIAL-0.3]
R76  value 1k  [AXIAL-0.3]
R77  value 1k  [AXIAL-0.3]
R78  value 1k  [AXIAL-0.3]
R79  value 2k4  [AXIAL-0.3]
R80  value 2k4  [AXIAL-0.3]
U13  74V1T04STR

### Blocks framed on the sheet
Spare Digital Input 1: D24 D26 R72 R73
Spare Digital Input 2: D25 D27 R74 R75

### Ports
PE0 (out), PE1 (out), PJ0 (out), PJ1 (out), SPARE DIN 1 (in), SPARE DIN 2 (in)

### Nets
SENSOR GND: D24.1(A) D25.1(A) D26.1(A) D27.1(A) D28.1(A) D29.1(A) D30.2(K) R80.1 U13.3(GND)
+5V MICRO: U13.6(VCC) ; off-sheet +5V MICRO
+5V SWITCHED: D24.2(K) D25.2(K) D28.2(K) ; off-sheet +5V SWITCHED
+12V BRV/WAKEUP: R77.2 R79.2 R80.2 ; off-sheet +12V BRV/WAKEUP
PE0: R76.2 ; port PE0
PE1: R78.2 ; port PE1
PJ0: R72.2 ; port PJ0
PJ1: R74.2 ; port PJ1
SPARE DIN 1: R73.2 ; port SPARE DIN 1
SPARE DIN 2: R75.2 ; port SPARE DIN 2
NetD24_3: D24.3(A2) D26.2(K) R72.1 R73.1
NetD25_3: D25.3(A2) D27.2(K) R74.1 R75.1
NetD28_3: D28.3(A2) D29.2(K) R77.1 U13.2(1A)
NetD30_1: D30.1(A) R79.1
NetR76_1: R76.1 R78.1 U13.4(1Y)

Not connected (* = marked no-connect by the designer): U13 1(NC)* 5(NC)*

### Notes on the sheet
- All inputs 12V capable.
- (near R78) CPU Wakeup Input
- Wake Up Signal Conditioning
- Title
- Size:
- Date:
- A4
- Number:
- Time:
- Revision:
- Sheet
- of

### Library data of the parts
D24 D25 D28 = BAT721S: DUAL SCHOTTKY DIODE
D26 D27 D29 = D Zener: Zener Diode; Published: 8-Jun-2000; LatestRevisionDate: 17-Jul-2002; LatestRevisionNote: Re-released for DXP Platform.; PackageReference: DIODE-0.7; Publisher: Altium Limited; PackageDescription: Diode, Thru-Hole; 2 Leads; 0.7 in Pin Spacing
D30 = LED0: Typical INFRARED GaAs LED; Published: 8-Jun-2000; LatestRevisionDate: 08-Jul-2005; LatestRevisionNote: Mech Layer 1 removed.; PackageReference: LED-0; Publisher: Altium Limited; PackageDescription: LED; 2 Leads
R72-R80 = Res1: Resistor; Published: 8-Jun-2000; LatestRevisionDate: 17-Jul-2002; LatestRevisionNote: Re-released for DXP Platform.; PackageReference: AXIAL-0.3; Publisher: Altium Limited; PackageDescription: Axial Device, Thru-Hole; 2 Leads; 0.3 in Pin Spacing

## Sheet USB Comms.SchDoc: Ravage - USB Comms
size A4; Address1: Drawn By:; Address2: Dan Visser; DocumentNumber: A; Revision: 0.1-alpha; SheetNumber: 3; SheetTotal: 16
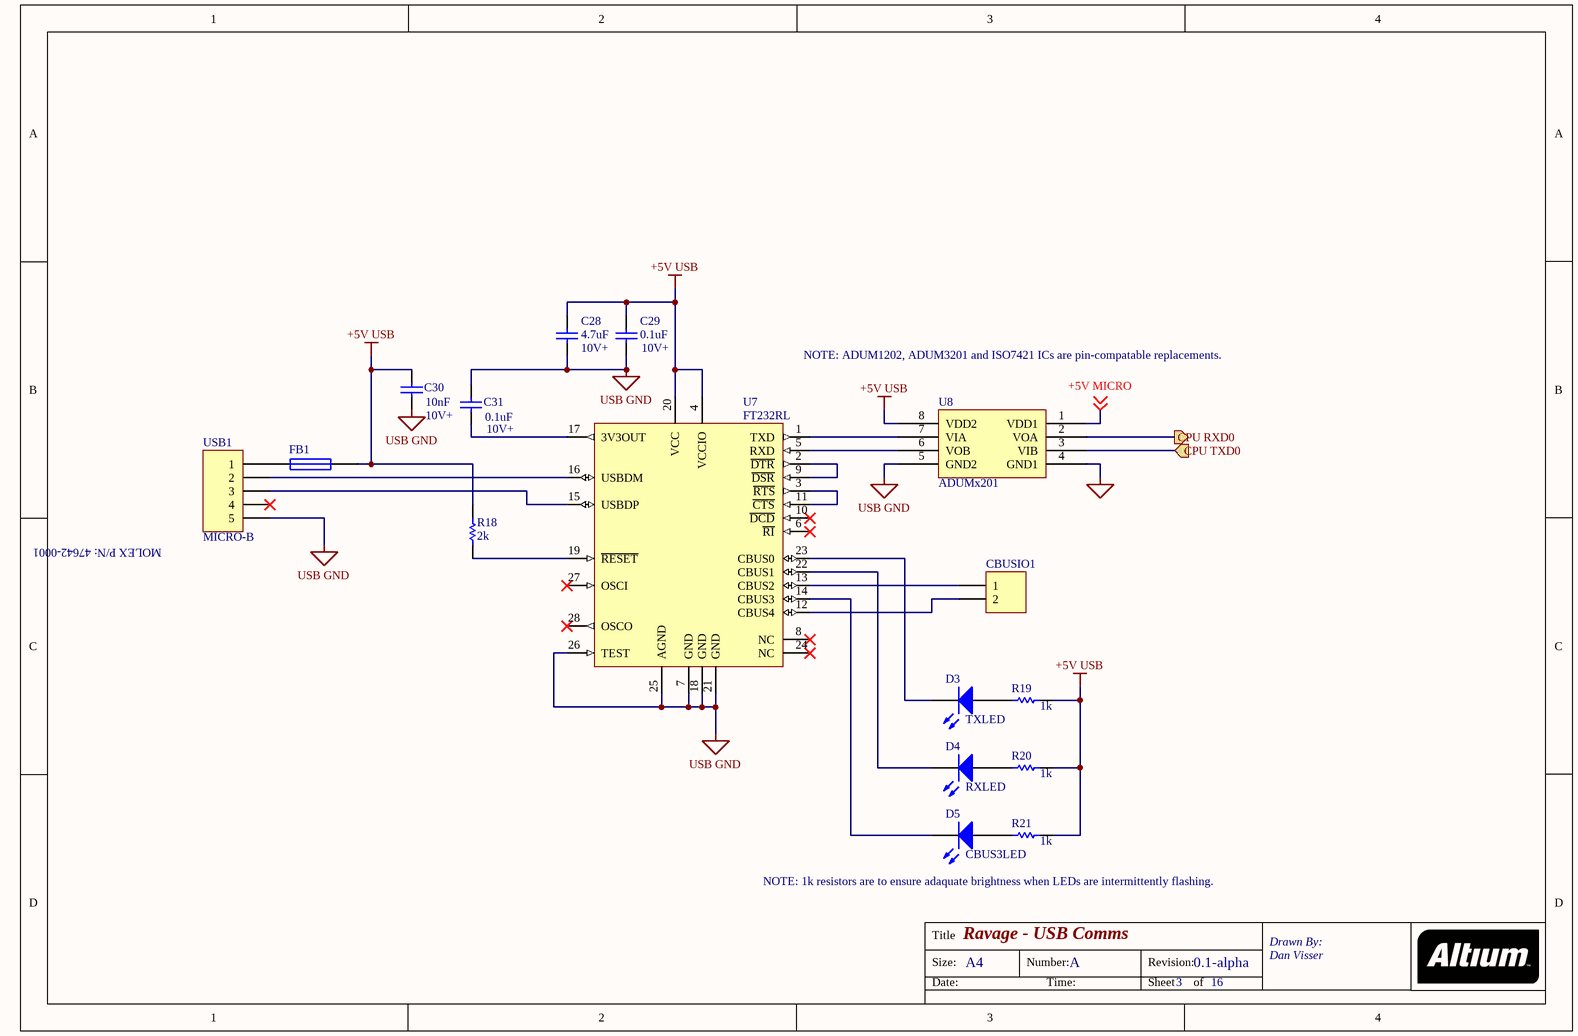
[diagram p4: USB Comms.SchDoc]

### Parts
C28  value 4.7uF  [RAD-0.3]
C29  value 0.1uF  [RAD-0.3]
C30  value 10nF  [RAD-0.3]
C31  value 0.1uF  [RAD-0.3]
CBUSIO1  (no value)  [HDR1X2]
D3  TXLED  [LED-0]
D4  RXLED  [LED-0]
D5  CBUS3LED  [LED-0]
FB1  (no value)  [PIN-W2/E2.8]
R18  value 2k  [AXIAL-0.3]
R19  value 1k  [AXIAL-0.3]
R20  value 1k  [AXIAL-0.3]
R21  value 1k  [AXIAL-0.3]
U7  FT232RL  [SSOP-28_M]
U8  ADUMx201
USB1  MICRO-B  [HDR1X5]

### Ports
CPU RXD0 (out), CPU TXD0 (in)

### Nets
+5V USB: C28.2 C29.2 C30.2 FB1.2 R18.2 R19.2 R20.2 R21.2 U7.4(VCCIO) U7.20(VCC) U8.8(VDD2)
SENSOR GND: U8.4(GND1)
USB GND: C28.1 C29.1 C30.1 C31.2 U7.7(GND) U7.18(GND) U7.21(GND) U7.25(AGND) U7.26(TEST) U8.5(GND2) USB1.5
+5V MICRO: U8.1(VDD1) ; off-sheet +5V MICRO
CPU RXD0: U8.2(VOA) ; port CPU RXD0
CPU TXD0: U8.3(VIB) ; port CPU TXD0
NetC31_1: C31.1 U7.17(3V3OUT)
NetCBUSIO1_1: CBUSIO1.1 U7.13(CBUS2)
NetCBUSIO1_2: CBUSIO1.2 U7.12(CBUS4)
NetD3_1: D3.1(A) R19.1
NetD3_2: D3.2(K) U7.23(CBUS0)
NetD4_1: D4.1(A) R20.1
NetD4_2: D4.2(K) U7.22(CBUS1)
NetD5_1: D5.1(A) R21.1
NetD5_2: D5.2(K) U7.14(CBUS3)
NetR18_1: R18.1 U7.19(~{RESET})
NetU7_1: U7.1(TXD) U8.7(VIA)
NetU7_2: U7.2(~{DTR}) U7.9(~{DSR})
NetU7_3: U7.3(~{RTS}) U7.11(~{CTS})
NetU7_5: U7.5(RXD) U8.6(VOB)
NetU7_15: U7.15(USBDP) USB1.3
NetU7_16: U7.16(USBDM) USB1.2

Not connected (* = marked no-connect by the designer): FB1 1; U7 6(~{RI})* 8(NC)* 10(~{DCD})* 24(NC)* 27(OSCI)* 28(OSCO)*; USB1 1 4*

### Notes on the sheet
- 10V+
- (near C29) 10V+
- NOTE: ADUM1202, ADUM3201 and ISO7421 ICs are pin-compatable replacements.
- (near C31) 10V+
- (near USB1) MOLEX P/N: 47642-0001
- NOTE: 1k resistors are to ensure adaquate brightness when LEDs are intermittently flashing.
- Title
- Size:
- Date:
- A4
- Number:
- Time:
- Revision:
- Sheet
- of

### Library data of the parts
C28-C31 = Cap: Capacitor; Published: 8-Jun-2000; LatestRevisionDate: 17-Jul-2002; LatestRevisionNote: Re-released for DXP Platform.; PackageReference: RAD-0.3; Publisher: Altium Limited; PackageDescription: Radial Cap, Thru-Hole; 2 Leads; 0.3 in Pin Spacing
CBUSIO1 = Header 2: Header, 2-Pin; LatestRevisionDate: 17-Jul-2002; LatestRevisionNote: Re-released for DXP Platform.; Publisher: Altium Limited
D3-D5 = LED0: Typical INFRARED GaAs LED; Published: 8-Jun-2000; LatestRevisionDate: 08-Jul-2005; LatestRevisionNote: Mech Layer 1 removed.; PackageReference: LED-0; Publisher: Altium Limited; PackageDescription: LED; 2 Leads
FB1 = Fuse 1: Published: 8-Jun-2000; LatestRevisionDate: 17-Jul-2002; LatestRevisionNote: Re-released for DXP Platform.; PackageReference: PIN-W2/E2.8; Publisher: Altium Limited; PackageDescription: Thru-Hole; 2 Leads
R18-R21 = Res1: Resistor; Published: 8-Jun-2000; LatestRevisionDate: 17-Jul-2002; LatestRevisionNote: Re-released for DXP Platform.; PackageReference: AXIAL-0.3; Publisher: Altium Limited; PackageDescription: Axial Device, Thru-Hole; 2 Leads; 0.3 in Pin Spacing
U7 = FT232RL-Tray: USB UART Asynchronous Serial Data Transfer Chip, SSOP-28, Tray; Published: 19-Aug-2010; DatasheetVersion: ver 2.07, Jul-2010; PackageVersion: 2010; PackageReference: SSOP-28; Publisher: Altium Limited; PackageDescription: 28-Pin Small Outline Package 0.65 mm Pitch; ComponentLink1Description: Manufacturer Link; ComponentLink1URL: http://www.ftdichip.com/Products/ICs/FT232R.htm; ComponentLink2Description: Datasheet; ComponentLink2URL: http://www.ftdichip.com/Support/Documents/DataSheets/ICs/DS_FT232R.pdf
U8 = ADUM3201
USB1 = Header 5: Header, 5-Pin; LatestRevisionDate: 17-Jul-2002; LatestRevisionNote: Re-released for DXP Platform.; Publisher: Altium Limited

## Sheet 3-Wire ISCV Driver.SchDoc: Ravage - 3-Wire ISCV Driver
size A4; Address1: Drawn By:; Address2: Dan Visser; DocumentNumber: A; Revision: 0.1-alpha; SheetNumber: 13; SheetTotal: 16
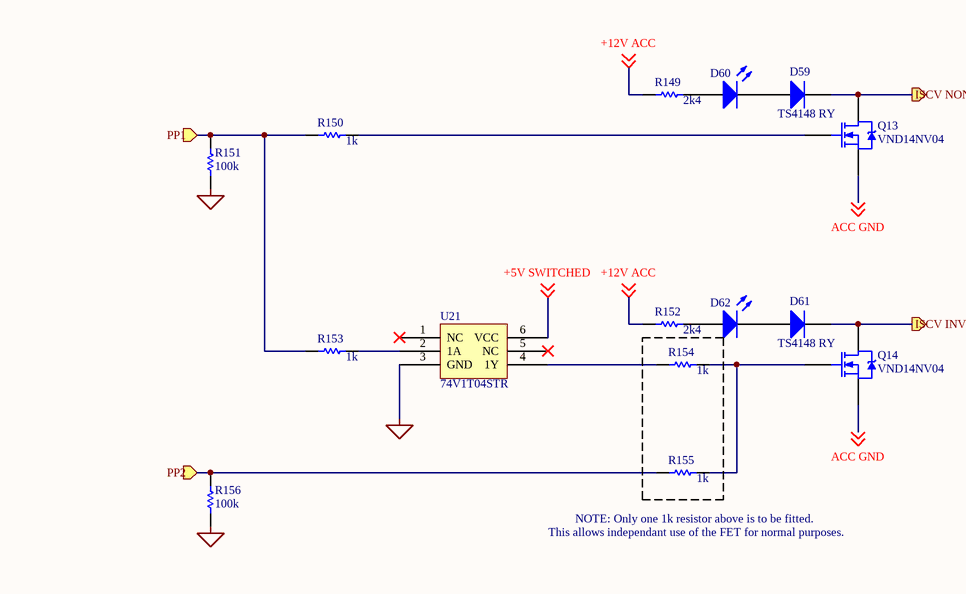
[diagram p5: 3-Wire ISCV Driver.SchDoc]

### Parts
D59  TS4148 RY  [SMC]
D60  (no value)  [LED-0]
D61  TS4148 RY  [SMC]
D62  (no value)  [LED-0]
Q13  VND14NV04  [TO-220AB]
Q14  VND14NV04  [TO-220AB]
R149  value 2k4  [AXIAL-0.3]
R150  value 1k  [AXIAL-0.3]
R151  value 100k  [AXIAL-0.3]
R152  value 2k4  [AXIAL-0.3]
R153  value 1k  [AXIAL-0.3]
R154  value 1k  [AXIAL-0.3]
R155  value 1k  [AXIAL-0.3]
R156  value 100k  [AXIAL-0.3]
U21  74V1T04STR

### Ports
ISCV INV (out), ISCV NON-INV (out), PP1 (in), PP2 (in)

### Nets
SENSOR GND: R151.1 R156.1 U21.3(GND)
+5V SWITCHED: U21.6(VCC) ; off-sheet +5V SWITCHED
+12V ACC: R149.1 R152.1 ; off-sheet +12V ACC
ACC GND: Q13.3(S) Q14.3(S) ; off-sheet ACC GND
ISCV INV: D61.2(K) Q14.2(D) ; port ISCV INV
ISCV NON-INV: D59.2(K) Q13.2(D) ; port ISCV NON-INV
PP1: R150.1 R151.2 R153.1 ; port PP1
PP2: R155.1 R156.2 ; port PP2
NetD59_1: D59.1(A) D60.2(K)
NetD60_1: D60.1(A) R149.2
NetD61_1: D61.1(A) D62.2(K)
NetD62_1: D62.1(A) R152.2
NetQ13_1: Q13.1(G) R150.2
NetQ14_1: Q14.1(G) R154.2 R155.2
NetR153_2: R153.2 U21.2(1A)
NetR154_1: R154.1 U21.4(1Y)

Not connected (* = marked no-connect by the designer): U21 1(NC)* 5(NC)*

### Notes on the sheet
- This allows independant use of the FET for normal purposes.
- (near R155) NOTE: Only one 1k resistor above is to be fitted.
- Title
- Size:
- Date:
- A4
- Number:
- Time:
- Revision:
- Sheet
- of

### Library data of the parts
D59 D61 = Diode: Default Diode; Published: 8-Jun-2000; LatestRevisionDate: 17-Jul-2002; LatestRevisionNote: Re-released for DXP Platform.; PackageVersion: Sep-1996; PackageReference: SMC; Publisher: Altium Limited; PackageDescription: DO-214-AB/SMC; 2 C-Bend Leads; Body 7.9 x 5.9 mm, inc. leads (LxW); Code_JEDEC: DO-214-AB
D60 D62 = LED0: Typical INFRARED GaAs LED; Published: 8-Jun-2000; LatestRevisionDate: 08-Jul-2005; LatestRevisionNote: Mech Layer 1 removed.; PackageReference: LED-0; Publisher: Altium Limited; PackageDescription: LED; 2 Leads
Q13 Q14 = IRL520N: as Q2 on sheet Injectors; Published: 8-Jun-2000; LatestRevisionDate: 17-Jul-2002; LatestRevisionNote: Re-released for DXP Platform.; DatasheetVersion: May-1998; PackageVersion: Feb-1997; PackageReference: TO-220AB; Publisher: Altium Limited; PackageDescription: TO, Thru-Hole, Vertical, Heatsink Mounted; 3 In-Line Leads; Pitch 2.54 mm; ComponentLink1Description: Manufacturer Link; ComponentLink1URL: http://www.irf.com/; ComponentLink2Description: Datasheet; ComponentLink2URL: http://www.irf.com/product-info/datasheets/data/irl520n.pdf
R149-R156 = Res1: Resistor; Published: 8-Jun-2000; LatestRevisionDate: 17-Jul-2002; LatestRevisionNote: Re-released for DXP Platform.; PackageReference: AXIAL-0.3; Publisher: Altium Limited; PackageDescription: Axial Device, Thru-Hole; 2 Leads; 0.3 in Pin Spacing

## Sheet Power Supplies.SchDoc: Ravage - Power Supplies
size A4; Address1: Drawn By:; Address2: Dan Visser; DocumentNumber: A; Revision: 0.1-alpha; SheetNumber: 2; SheetTotal: 16; PageSetup: Record=PageOptions|CenterHorizontal=True|CenterVertical=True|PrintScale=0.97|XCorrection=1.00|YCorrection=1.00|PrintKind=1|BorderSize=5000000|LeftOffset=0|BottomOffset=0|Orientation=2|PaperLength=1000|PaperWidth=1000|Scale=100|PaperSource=1274|PrintQuality=600|MediaType=1|DitherType=10|PaperKind=A4|PrintScaleMode=1
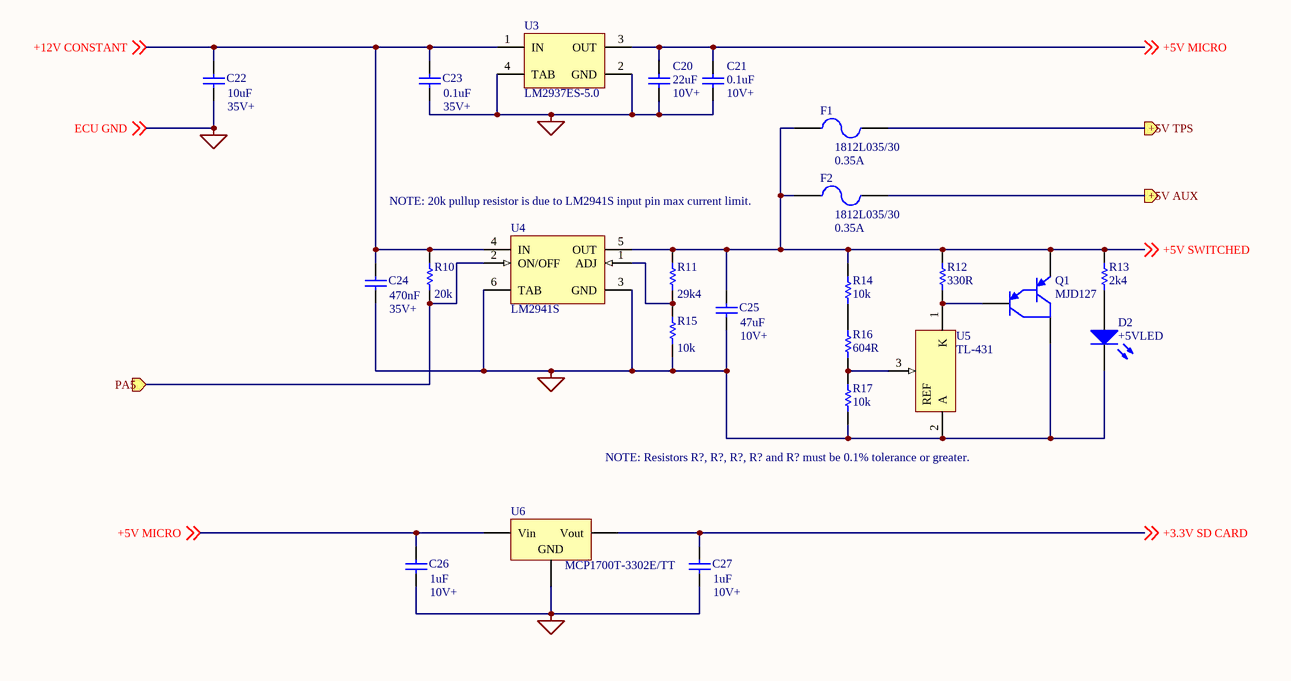
[diagram p6: Power Supplies.SchDoc]

### Parts
C20  value 22uF  [RAD-0.3]
C21  value 0.1uF  [RAD-0.3]
C22  value 10uF  [RAD-0.3]
C23  value 0.1uF  [RAD-0.3]
C24  value 470nF  [RAD-0.3]
C25  value 47uF  [RAD-0.3]
C26  value 1uF  [RAD-0.3]
C27  value 1uF  [RAD-0.3]
D2  +5VLED  [LED-0]
F1  1812L035/30  [PIN-W2/E2.8]
F2  1812L035/30  [PIN-W2/E2.8]
Q1  MJD127  [E3]
R10  value 20k  [AXIAL-0.3]
R11  value 29k4  [AXIAL-0.3]
R12  value 330R  [AXIAL-0.3]
R13  value 2k4  [AXIAL-0.3]
R14  value 10k  [AXIAL-0.3]
R15  value 10k  [AXIAL-0.3]
R16  value 604R  [AXIAL-0.3]
R17  value 10k  [AXIAL-0.3]
U3  LM2937ES-5.0  [TS3B_N]
U4  LM2941S  [TS5B_N]
U5  TL-431
U6  MCP1700T-3302E/TT  [SOT-23-NB3_M]

### Ports
+5V AUX (out), +5V TPS (out), PA5 (in)

### Nets
ECU GND: C20.1 C21.1 C22.1 C23.1 C24.1 C25.1 C26.1 C27.1 D2.2(K) Q1.3(C) R15.1 R17.1 U3.2(GND) U3.4(TAB) U4.3(GND) U4.6(TAB) U5.2(A) U6.1 ; off-sheet ECU GND  [project net SENSOR GND]
+3.3V SD CARD: C27.2 U6.2(Vout) ; off-sheet +3.3V SD CARD
+5V AUX: F2.2 ; port +5V AUX
+5V MICRO: C20.2 C21.2 C26.2 U3.3(OUT) U6.3(Vin) ; off-sheet +5V MICRO
+5V SWITCHED: C25.2 F1.1 F2.1 Q1.1(E) R11.2 R12.2 R13.2 R14.2 U4.5(OUT) ; off-sheet +5V SWITCHED
+5V TPS: F1.2 ; port +5V TPS
+12V CONSTANT: C22.2 C23.2 C24.2 R10.2 U3.1(IN) U4.4(IN) ; off-sheet +12V CONSTANT
PA5: R10.1 U4.2(ON/OFF) ; port PA5
NetD2_1: D2.1(A) R13.1
NetQ1_2: Q1.2(B) R12.1 U5.1(K)
NetR11_1: R11.1 R15.2 U4.1(ADJ)
NetR14_1: R14.1 R16.2
NetR16_1: R16.1 R17.2 U5.3(REF)

### Notes on the sheet
- 10V+
- (near C21) 10V+
- (near C22) 35V+
- (near C23) 35V+
- 0.35A
- (near F2) NOTE: 20k pullup resistor is due to LM2941S input pin max current limit.
- 35V+
- (near C25) 10V+
- NOTE: Resistors R?, R?, R?, R? and R? must be 0.1% tolerance or greater.
- (near C26) 10V+
- (near C27) 10V+
- Title
- Size:
- Date:
- A4
- Number:
- Time:
- Revision:
- Sheet
- of
- (in symbol Volt Reg) GND

### Library data of the parts
C20-C27 = Cap: Capacitor; Published: 8-Jun-2000; LatestRevisionDate: 17-Jul-2002; LatestRevisionNote: Re-released for DXP Platform.; PackageReference: RAD-0.3; Publisher: Altium Limited; PackageDescription: Radial Cap, Thru-Hole; 2 Leads; 0.3 in Pin Spacing
D2 = LED0: Typical INFRARED GaAs LED; Published: 8-Jun-2000; LatestRevisionDate: 08-Jul-2005; LatestRevisionNote: Mech Layer 1 removed.; PackageReference: LED-0; Publisher: Altium Limited; PackageDescription: LED; 2 Leads
F1 F2 = Fuse 2: Fuse; Published: 8-Jun-2000; LatestRevisionDate: 17-Jul-2002; LatestRevisionNote: Re-released for DXP Platform.; PackageReference: PIN-W2/E2.8; Publisher: Altium Limited; PackageDescription: Thru-Hole; 2 Leads
Q1 = PNP1: PNP Darlington Bipolar Transistor; Published: 8-Jun-2000; LatestRevisionDate: 17-Jul-2002; LatestRevisionNote: Re-released for DXP Platform.; DatasheetVersion: May-1994; PackageVersion: 1995/1996; PackageReference: E3; Publisher: Altium Limited; PackageDescription: TO, Flat Index; 3 In-Line, Axial Leads; Body Dia. 4.6mm; Lead Dia. 0.5 mm (max); ComponentLink1Description: Manufacturer Link; ComponentLink1URL: http://www.zetex.com/
R10-R17 = Res1: Resistor; Published: 8-Jun-2000; LatestRevisionDate: 17-Jul-2002; LatestRevisionNote: Re-released for DXP Platform.; PackageReference: AXIAL-0.3; Publisher: Altium Limited; PackageDescription: Axial Device, Thru-Hole; 2 Leads; 0.3 in Pin Spacing
U3 = LM2937ES-5.0: 500 mA Low Dropout Regulator, 3-pin TO-263; Manufacturer: National Semiconductor; PackageTopMarking: NSUZXYTTE#*LM2937ES*-5.0; PowerWise: N; CompType: LDO IC; Published: 4-Dec-2008; DatasheetVersion: Aug-2005; PackageVersion: revF, Apr-2005; PackageReference: TS3B; Publisher: Altium Limited; PackageDescription: TO-263, Molded, .400 x .390 x .180in, 3 Lead, .1in Pitch, Surface Mount; PartNumber: LM2937ES-5.0; RoHS: N; PinCount: 3; Code_JEDEC: MO-169-AA; ComponentLink1Description: LM2937 Datasheet; ComponentLink1URL: http://www.national.com/ds/LM/LM2937.pdf; ComponentLink2Description: LM2937 Web Page; ComponentLink2URL: http://www.national.com/pf/LM/LM2937.html; ComponentLink3Description: TS3B Package Page; ComponentLink3URL: http://www.national.com/packaging/folders/ts3b.html
U4 = LM2941S: 1A Low Dropout Adjustable Regulator, 5-pin TO-263; Manufacturer: National Semiconductor; PackageTopMarking: NSUZXYTTE#*LM2941S*P+; PowerWise: N; CompType: LDO IC; Published: 4-Dec-2008; DatasheetVersion: Nov-2007; PackageVersion: revD, Apr-2005; PackageReference: TS5B; Publisher: Altium Limited; PackageDescription: TO-263, Molded, .400 x .390 x .180in, 5 Lead, .067in Pitch, Surface Mount; Supplier 1: Farnell; Supplier Part Number 1: 9494456; PartNumber: LM2941S; RoHS: N; PinCount: 5; Code_JEDEC: MO-169-AB; ComponentLink1Description: LM2941 Datasheet; ComponentLink1URL: http://www.national.com/ds/LM/LM2941.pdf; ComponentLink2Description: LM2941 Web Page; ComponentLink2URL: http://www.national.com/pf/LM/LM2941.html; ComponentLink3Description: TS5B Package Page; ComponentLink3URL: http://www.national.com/packaging/folders/ts5b.html
U5 = PM-REF-431-SIL3
U6 = Volt Reg: Voltage Regulator; Published: 24-Mar-1999; LatestRevisionDate: 29-May-2009; LatestRevisionNote: IPC-7351 Footprint Added.; PackageReference: D2PAK; Publisher: Altium Limited; PackageDescription: 3-Pin Transistor Outline Package 2.54 mm Pitch, 15.1 mm Lead Span

## Sheet VR Interfaces.SchDoc: Ravage - VR Interfaces
size A4; Address1: Drawn By:; Address2: Dan Visser; DocumentNumber: A; Revision: 0.1-alpha; SheetNumber: 5; SheetTotal: 16
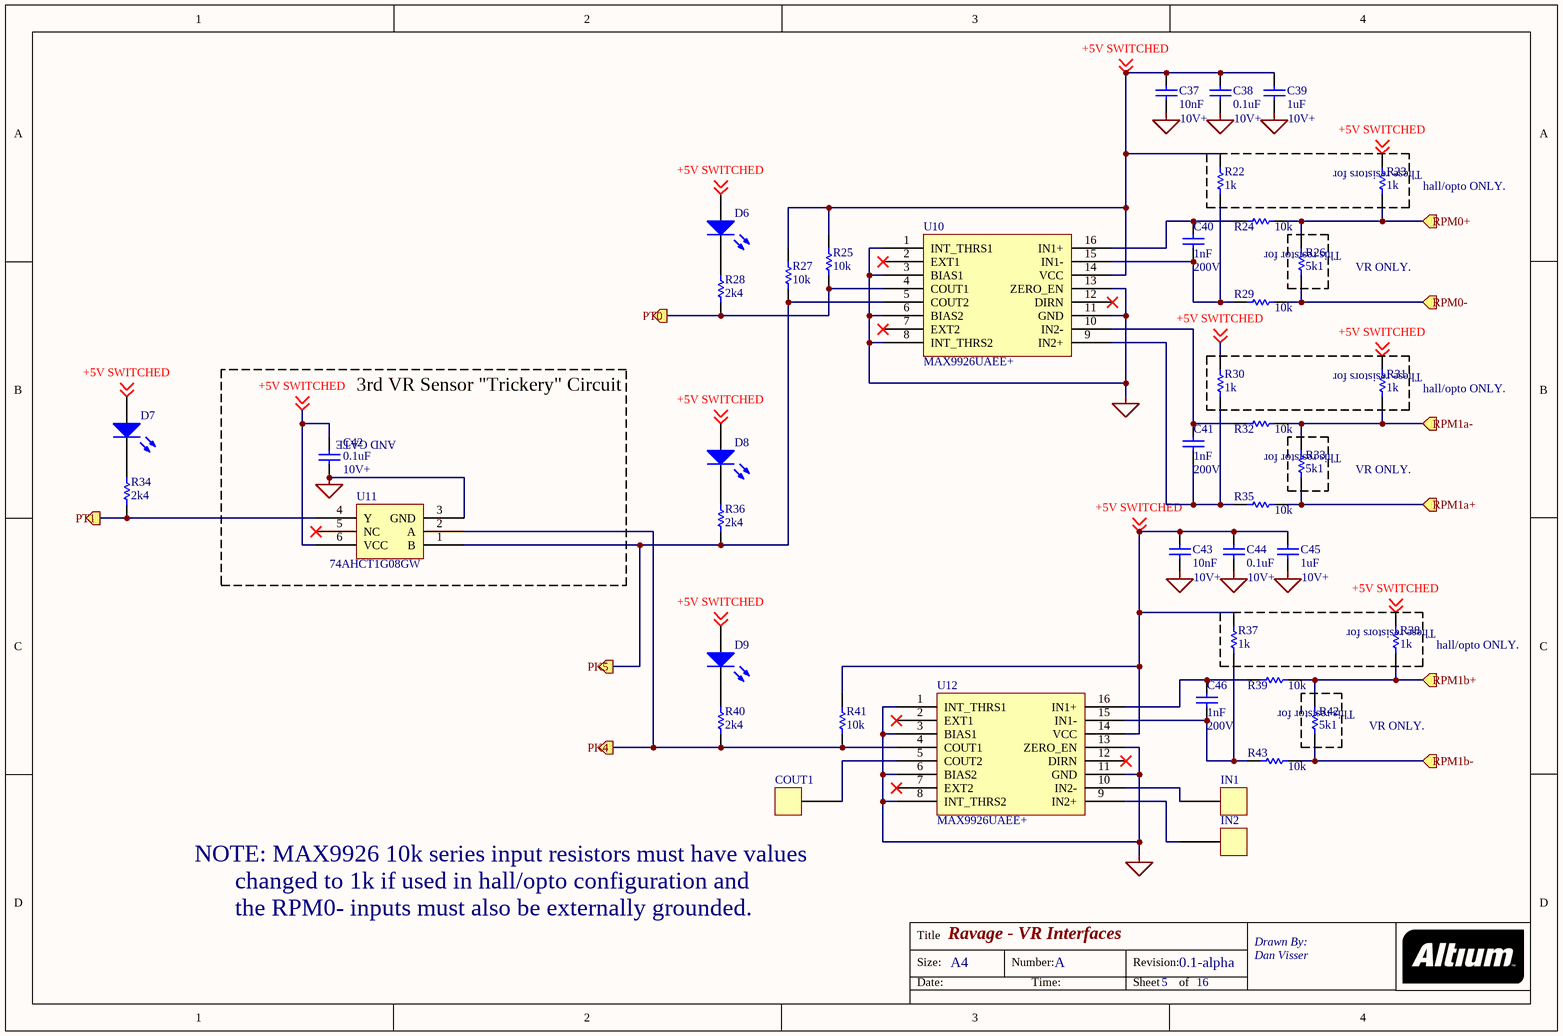
[diagram p7: VR Interfaces.SchDoc]

### Parts
C37  value 10nF  [RAD-0.3]
C38  value 0.1uF  [RAD-0.3]
C39  value 1uF  [RAD-0.3]
C40  value 1nF  [RAD-0.3]
C41  value 1nF  [RAD-0.3]
C42  value 0.1uF  [RAD-0.3]
C43  value 10nF  [RAD-0.3]
C44  value 0.1uF  [RAD-0.3]
C45  value 1uF  [RAD-0.3]
C46  value 1nF  [RAD-0.3]
COUT1  (no value)
D6  (no value)  [LED-0]
D7  (no value)  [LED-0]
D8  (no value)  [LED-0]
D9  (no value)  [LED-0]
IN1  (no value)
IN2  (no value)
R22  value 1k  [AXIAL-0.3]
R23  value 1k  [AXIAL-0.3]
R24  value 10k  [AXIAL-0.3]
R25  value 10k  [AXIAL-0.3]
R26  value 5k1  [AXIAL-0.3]
R27  value 10k  [AXIAL-0.3]
R28  value 2k4  [AXIAL-0.3]
R29  value 10k  [AXIAL-0.3]
R30  value 1k  [AXIAL-0.3]
R31  value 1k  [AXIAL-0.3]
R32  value 10k  [AXIAL-0.3]
R33  value 5k1  [AXIAL-0.3]
R34  value 2k4  [AXIAL-0.3]
R35  value 10k  [AXIAL-0.3]
R36  value 2k4  [AXIAL-0.3]
R37  value 1k  [AXIAL-0.3]
R38  value 1k  [AXIAL-0.3]
R39  value 10k  [AXIAL-0.3]
R40  value 2k4  [AXIAL-0.3]
R41  value 10k  [AXIAL-0.3]
R42  value 5k1  [AXIAL-0.3]
R43  value 10k  [AXIAL-0.3]
U10  MAX9926UAEE+
U11  74AHCT1G08GW
U12  MAX9926UAEE+

### Blocks framed on the sheet
3rd VR Sensor "Trickery" Circuit: C42 U11

### Ports
PK4 (out), PK5 (out), PT0 (out), PT1 (out), RPM0+ (in), RPM0- (in), RPM1a+ (in), RPM1a- (in), RPM1b+ (in), RPM1b- (in)

### Nets
SENSOR GND: C37.1 C38.1 C39.1 C42.1 C43.1 C44.1 C45.1 U10.1(INT_THRS1) U10.3(BIAS1) U10.6(BIAS2) U10.8(INT_THRS2) U10.11(GND) U10.13(ZERO_EN) U11.3(GND) U12.1(INT_THRS1) U12.3(BIAS1) U12.6(BIAS2) U12.8(INT_THRS2) U12.11(GND) U12.13(ZERO_EN)
+5V SWITCHED: C37.2 C38.2 C39.2 C42.2 C43.2 C44.2 C45.2 D6.1(A) D7.1(A) D8.1(A) D9.1(A) R22.2 R23.2 R25.2 R27.2 R30.2 R31.2 R37.2 R38.2 R41.2 U10.14(VCC) U11.6(VCC) U12.14(VCC) ; off-sheet +5V SWITCHED
PK4: R40.1 R41.1 U11.2(A) U12.4(COUT1) ; port PK4
PK5: R27.1 R36.1 U10.5(COUT2) U11.1(B) ; port PK5
PT0: R25.1 R28.1 U10.4(COUT1) ; port PT0
PT1: R34.1 U11.4(Y) ; port PT1
RPM0+: R23.1 R24.2 R26.2 ; port RPM0+
RPM0-: R26.1 R29.2 ; port RPM0-
RPM1a+: R33.1 R35.2 ; port RPM1a+
RPM1a-: R31.1 R32.2 R33.2 ; port RPM1a-
RPM1b+: R38.1 R39.2 R42.2 ; port RPM1b+
RPM1b-: R42.1 R43.2 ; port RPM1b-
NetC40_1: C40.1 R22.1 R29.1 U10.15(IN1-)
NetC40_2: C40.2 R24.1 U10.16(IN1+)
NetC41_1: C41.1 R30.1 R35.1 U10.9(IN2+)
NetC41_2: C41.2 R32.1 U10.10(IN2-)
NetC46_1: C46.1 R37.1 R43.1 U12.15(IN1-)
NetC46_2: C46.2 R39.1 U12.16(IN1+)
NetCOUT1_1: COUT1.1 U12.5(COUT2)
NetD6_2: D6.2(K) R28.2
NetD7_2: D7.2(K) R34.2
NetD8_2: D8.2(K) R36.2
NetD9_2: D9.2(K) R40.2
NetIN1_1: IN1.1 U12.10(IN2-)
NetIN2_1: IN2.1 U12.9(IN2+)

Not connected (* = marked no-connect by the designer): U10 2(EXT1)* 7(EXT2)* 12(DIRN)*; U11 5(NC)*; U12 2(EXT1)* 7(EXT2)* 12(DIRN)*

### Notes on the sheet
- 10V+
- (near C39) 10V+
- (near R23) These resistors for
- This resistor for
- (near R23) hall/opto ONLY.
- (near C40) 200V
- VR ONLY.
- (near R31) These resistors for
- AND GATE
- (near R31) hall/opto ONLY.
- (near C42) 10V+
- (near C41) 200V
- (near C45) 10V+
- (near R38) These resistors for
- (near R38) hall/opto ONLY.
- (near C46) 200V
- NOTE: MAX9926 10k series input resistors must have values
- changed to 1k if used in hall/opto configuration and
- the RPM0- inputs must also be externally grounded.
- Title
- Size:
- Date:
- A4
- Number:
- Time:
- Revision:
- Sheet
- of

### Library data of the parts
C37-C46 = Cap: Capacitor; Published: 8-Jun-2000; LatestRevisionDate: 17-Jul-2002; LatestRevisionNote: Re-released for DXP Platform.; PackageReference: RAD-0.3; Publisher: Altium Limited; PackageDescription: Radial Cap, Thru-Hole; 2 Leads; 0.3 in Pin Spacing
COUT1 IN1 IN2 = HEADER 1
D6-D9 = LED0: Typical INFRARED GaAs LED; Published: 8-Jun-2000; LatestRevisionDate: 08-Jul-2005; LatestRevisionNote: Mech Layer 1 removed.; PackageReference: LED-0; Publisher: Altium Limited; PackageDescription: LED; 2 Leads
R22-R43 = Res1: Resistor; Published: 8-Jun-2000; LatestRevisionDate: 17-Jul-2002; LatestRevisionNote: Re-released for DXP Platform.; PackageReference: AXIAL-0.3; Publisher: Altium Limited; PackageDescription: Axial Device, Thru-Hole; 2 Leads; 0.3 in Pin Spacing
U11 = NC7SZ32P5X

## Sheet Connector.SchDoc: Ravage - Connectors
size A4; Address1: Drawn By:; Address2: Dan Visser; DocumentNumber: A; Revision: 0.1-alpha; SheetNumber: 16; SheetTotal: 16
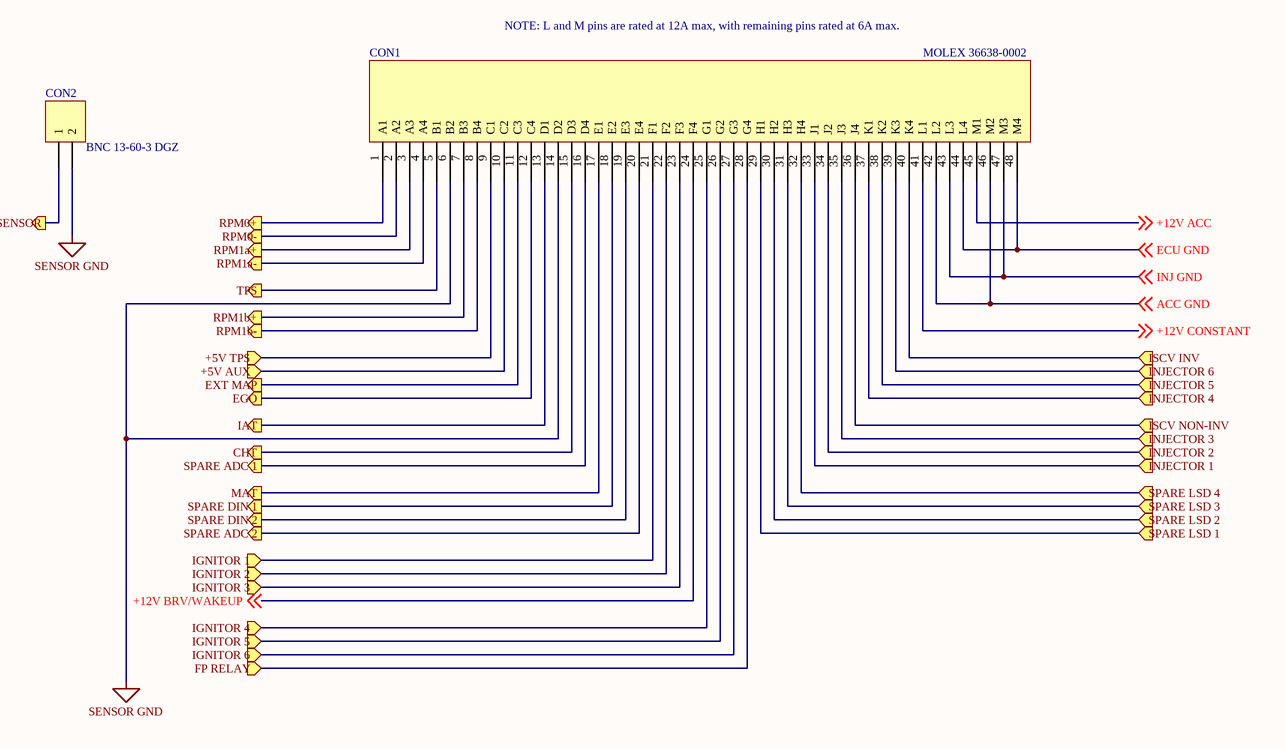
[diagram p8: Connector.SchDoc]

### Parts
CON1  MOLEX 36638-0002
CON2  BNC 13-60-3 DGZ  [HDR1X2]

### Ports
+5V AUX (in), +5V TPS (in), CHT (out), EGO (out), EXT MAP (out), FP RELAY (in), IAT (out), IGNITOR 1 (in), IGNITOR 2 (in), IGNITOR 3 (in), IGNITOR 4 (in), IGNITOR 5 (in), IGNITOR 6 (in), INJECTOR 1 (in), INJECTOR 2 (in), INJECTOR 3 (in), INJECTOR 4 (in), INJECTOR 5 (in), INJECTOR 6 (in), ISCV INV (in), ISCV NON-INV (in), KNOCK SENSOR (out), MAT (out), RPM0+ (out), RPM0- (out), RPM1a+ (out), RPM1a- (out), RPM1b+ (out), RPM1b- (out), SPARE ADC 1 (out), SPARE ADC 2 (out), SPARE DIN 1 (out), SPARE DIN 2 (out), SPARE LSD 1 (in), SPARE LSD 2 (in), SPARE LSD 3 (in), SPARE LSD 4 (in), TPS (out)

### Nets
SENSOR GND: CON1.6(B2) CON1.14(D2) CON2.2
+5V AUX: CON1.10(C2) ; port +5V AUX
+5V TPS: CON1.9(C1) ; port +5V TPS
+12V ACC: CON1.45(M1) ; off-sheet +12V ACC
+12V BRV/WAKEUP: CON1.24(F4) ; off-sheet +12V BRV/WAKEUP
+12V CONSTANT: CON1.41(L1) ; off-sheet +12V CONSTANT
ACC GND: CON1.42(L2) CON1.46(M2) ; off-sheet ACC GND
CHT: CON1.15(D3) ; port CHT
ECU GND: CON1.44(L4) CON1.48(M4) ; off-sheet ECU GND
EGO: CON1.12(C4) ; port EGO
EXT MAP: CON1.11(C3) ; port EXT MAP
FP RELAY: CON1.28(G4) ; port FP RELAY
IAT: CON1.13(D1) ; port IAT
IGNITOR 1: CON1.21(F1) ; port IGNITOR 1
IGNITOR 2: CON1.22(F2) ; port IGNITOR 2
IGNITOR 3: CON1.23(F3) ; port IGNITOR 3
IGNITOR 4: CON1.25(G1) ; port IGNITOR 4
IGNITOR 5: CON1.26(G2) ; port IGNITOR 5
IGNITOR 6: CON1.27(G3) ; port IGNITOR 6
INJ GND: CON1.43(L3) CON1.47(M3) ; off-sheet INJ GND
INJECTOR 1: CON1.33(J1) ; port INJECTOR 1
INJECTOR 2: CON1.34(J2) ; port INJECTOR 2
INJECTOR 3: CON1.35(J3) ; port INJECTOR 3
INJECTOR 4: CON1.37(K1) ; port INJECTOR 4
INJECTOR 5: CON1.38(K2) ; port INJECTOR 5
INJECTOR 6: CON1.39(K3) ; port INJECTOR 6
ISCV INV: CON1.40(K4) ; port ISCV INV
ISCV NON-INV: CON1.36(J4) ; port ISCV NON-INV
KNOCK SENSOR: CON2.1 ; port KNOCK SENSOR
MAT: CON1.17(E1) ; port MAT
RPM0+: CON1.1(A1) ; port RPM0+
RPM0-: CON1.2(A2) ; port RPM0-
RPM1a+: CON1.3(A3) ; port RPM1a+
RPM1a-: CON1.4(A4) ; port RPM1a-
RPM1b+: CON1.7(B3) ; port RPM1b+
RPM1b-: CON1.8(B4) ; port RPM1b-
SPARE ADC 1: CON1.16(D4) ; port SPARE ADC 1
SPARE ADC 2: CON1.20(E4) ; port SPARE ADC 2
SPARE DIN 1: CON1.18(E2) ; port SPARE DIN 1
SPARE DIN 2: CON1.19(E3) ; port SPARE DIN 2
SPARE LSD 1: CON1.29(H1) ; port SPARE LSD 1
SPARE LSD 2: CON1.30(H2) ; port SPARE LSD 2
SPARE LSD 3: CON1.31(H3) ; port SPARE LSD 3
TPS: CON1.5(B1) ; port TPS
NetCON1_32: CON1.32(H4) ; port SPARE LSD 4

### Notes on the sheet
- NOTE: L and M pins are rated at 12A max, with remaining pins rated at 6A max.
- Title
- Size:
- Date:
- A4
- Number:
- Time:
- Revision:
- Sheet
- of

### Library data of the parts
CON2 = Header 2: Header, 2-Pin; LatestRevisionDate: 17-Jul-2002; LatestRevisionNote: Re-released for DXP Platform.; Publisher: Altium Limited

## Sheet RS232 Comms.SchDoc: Ravage - RS232 Comms
size A4; Address1: Drawn By:; Address2: Dan Visser; DocumentNumber: A; Revision: 0.1-alpha; SheetNumber: 4; SheetTotal: 16
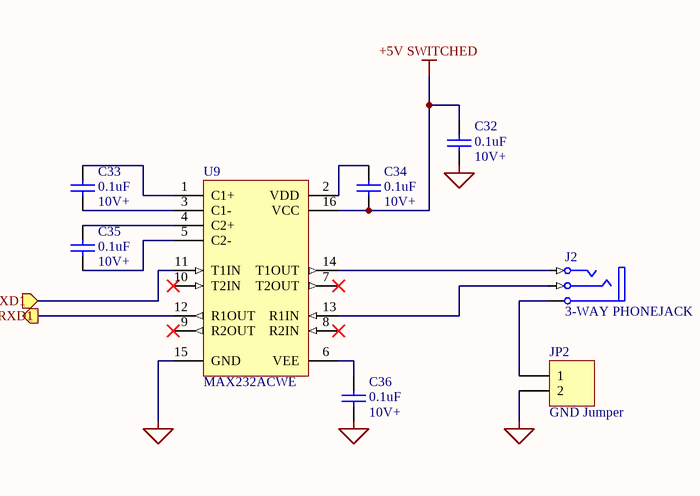
[diagram p9: RS232 Comms.SchDoc]

### Parts
C32  value 0.1uF  [RAD-0.3]
C33  value 0.1uF  [RAD-0.3]
C34  value 0.1uF  [RAD-0.3]
C35  value 0.1uF  [RAD-0.3]
C36  value 0.1uF  [RAD-0.3]
J2  3-WAY PHONEJACK  [JACK/6-V3]
JP2  GND Jumper  [HDR1X2]
U9  MAX232ACWE  [WSO16_N]

### Ports
CPU RXD1 (out), CPU TXD1 (in)

### Nets
+5V SWITCHED: C32.2 C34.1 U9.16(VCC)
SENSOR GND: C32.1 C36.1 JP2.2 U9.15(GND)
CPU RXD1: U9.12(R1OUT) ; port CPU RXD1
CPU TXD1: U9.11(T1IN) ; port CPU TXD1
NetC33_1: C33.1 U9.3(C1-)
NetC33_2: C33.2 U9.1(C1+)
NetC34_2: C34.2 U9.2(VDD)
NetC35_1: C35.1 U9.5(C2-)
NetC35_2: C35.2 U9.4(C2+)
NetC36_2: C36.2 U9.6(VEE)
NetJ2_1: J2.1(T) U9.14(T1OUT)
NetJ2_3: J2.3(R) U9.13(R1IN)
NetJ2_5: J2.5(S) JP2.1

Not connected (* = marked no-connect by the designer): U9 7(T2OUT)* 8(R2IN)* 9(R2OUT)* 10(T2IN)*

### Notes on the sheet
- (near C32) 10V+
- (near C33) 10V+
- (near C34) 10V+
- (near C35) 10V+
- (near C36) 10V+
- Title
- Size:
- Date:
- A4
- Number:
- Time:
- Revision:
- Sheet
- of

### Library data of the parts
C32-C36 = Cap: Capacitor; Published: 8-Jun-2000; LatestRevisionDate: 17-Jul-2002; LatestRevisionNote: Re-released for DXP Platform.; PackageReference: RAD-0.3; Publisher: Altium Limited; PackageDescription: Radial Cap, Thru-Hole; 2 Leads; 0.3 in Pin Spacing
J2 = Phonejack3: Jack Socket, 1/4" [6.5mm], Thru-Hole, Vertical, 3-Conductor Open Circuit (Non-Normalling); PackageDocument: 2003; PCB_Layout: Complies with manufacturer's recommendation.; DrillAndSlotSize: Corresponds to nominal value.; Published: 15-Jul-2004; LatestRevisionDate: 15-Jul-2004; LatestRevisionNote: Component Replaced.; DatasheetDocument: 2003; PackageReference: S1VS_SSS; Publisher: Altium Limited; ComponentLink1Description: Manufacturer Link; ComponentLink1URL: http://www.cliffuk.co.uk/
JP2 = Header 2: Header, 2-Pin; LatestRevisionDate: 17-Jul-2002; LatestRevisionNote: Re-released for DXP Platform.; Publisher: Altium Limited
U9 = MAX232ACWE: +5V Powered, Multi-Channel RS-232 Driver/Receiver; Published: 16-Jan-2001; LatestRevisionDate: 13-Apr-2006; LatestRevisionNote: IPC-7351 Footprint Added.; PackageReference: WSO16; Publisher: Altium Limited; PackageDescription: 16-Pin Small Outline Integrated Circuit 1.27 mm Pitch; Code_JEDEC: MS-013-AA; Code_IPC: SOIC127P1030-16; ComponentLink1Description: Manufacturer Link; ComponentLink1URL: http://www.maxim-ic.com/; ComponentLink2Description: Datasheet; ComponentLink2URL: http://pdfserv.maxim-ic.com/en/ds/MAX220-MAX249.pdf